# EAGLE design iBolit2_main (EAGLE 7.5.0)
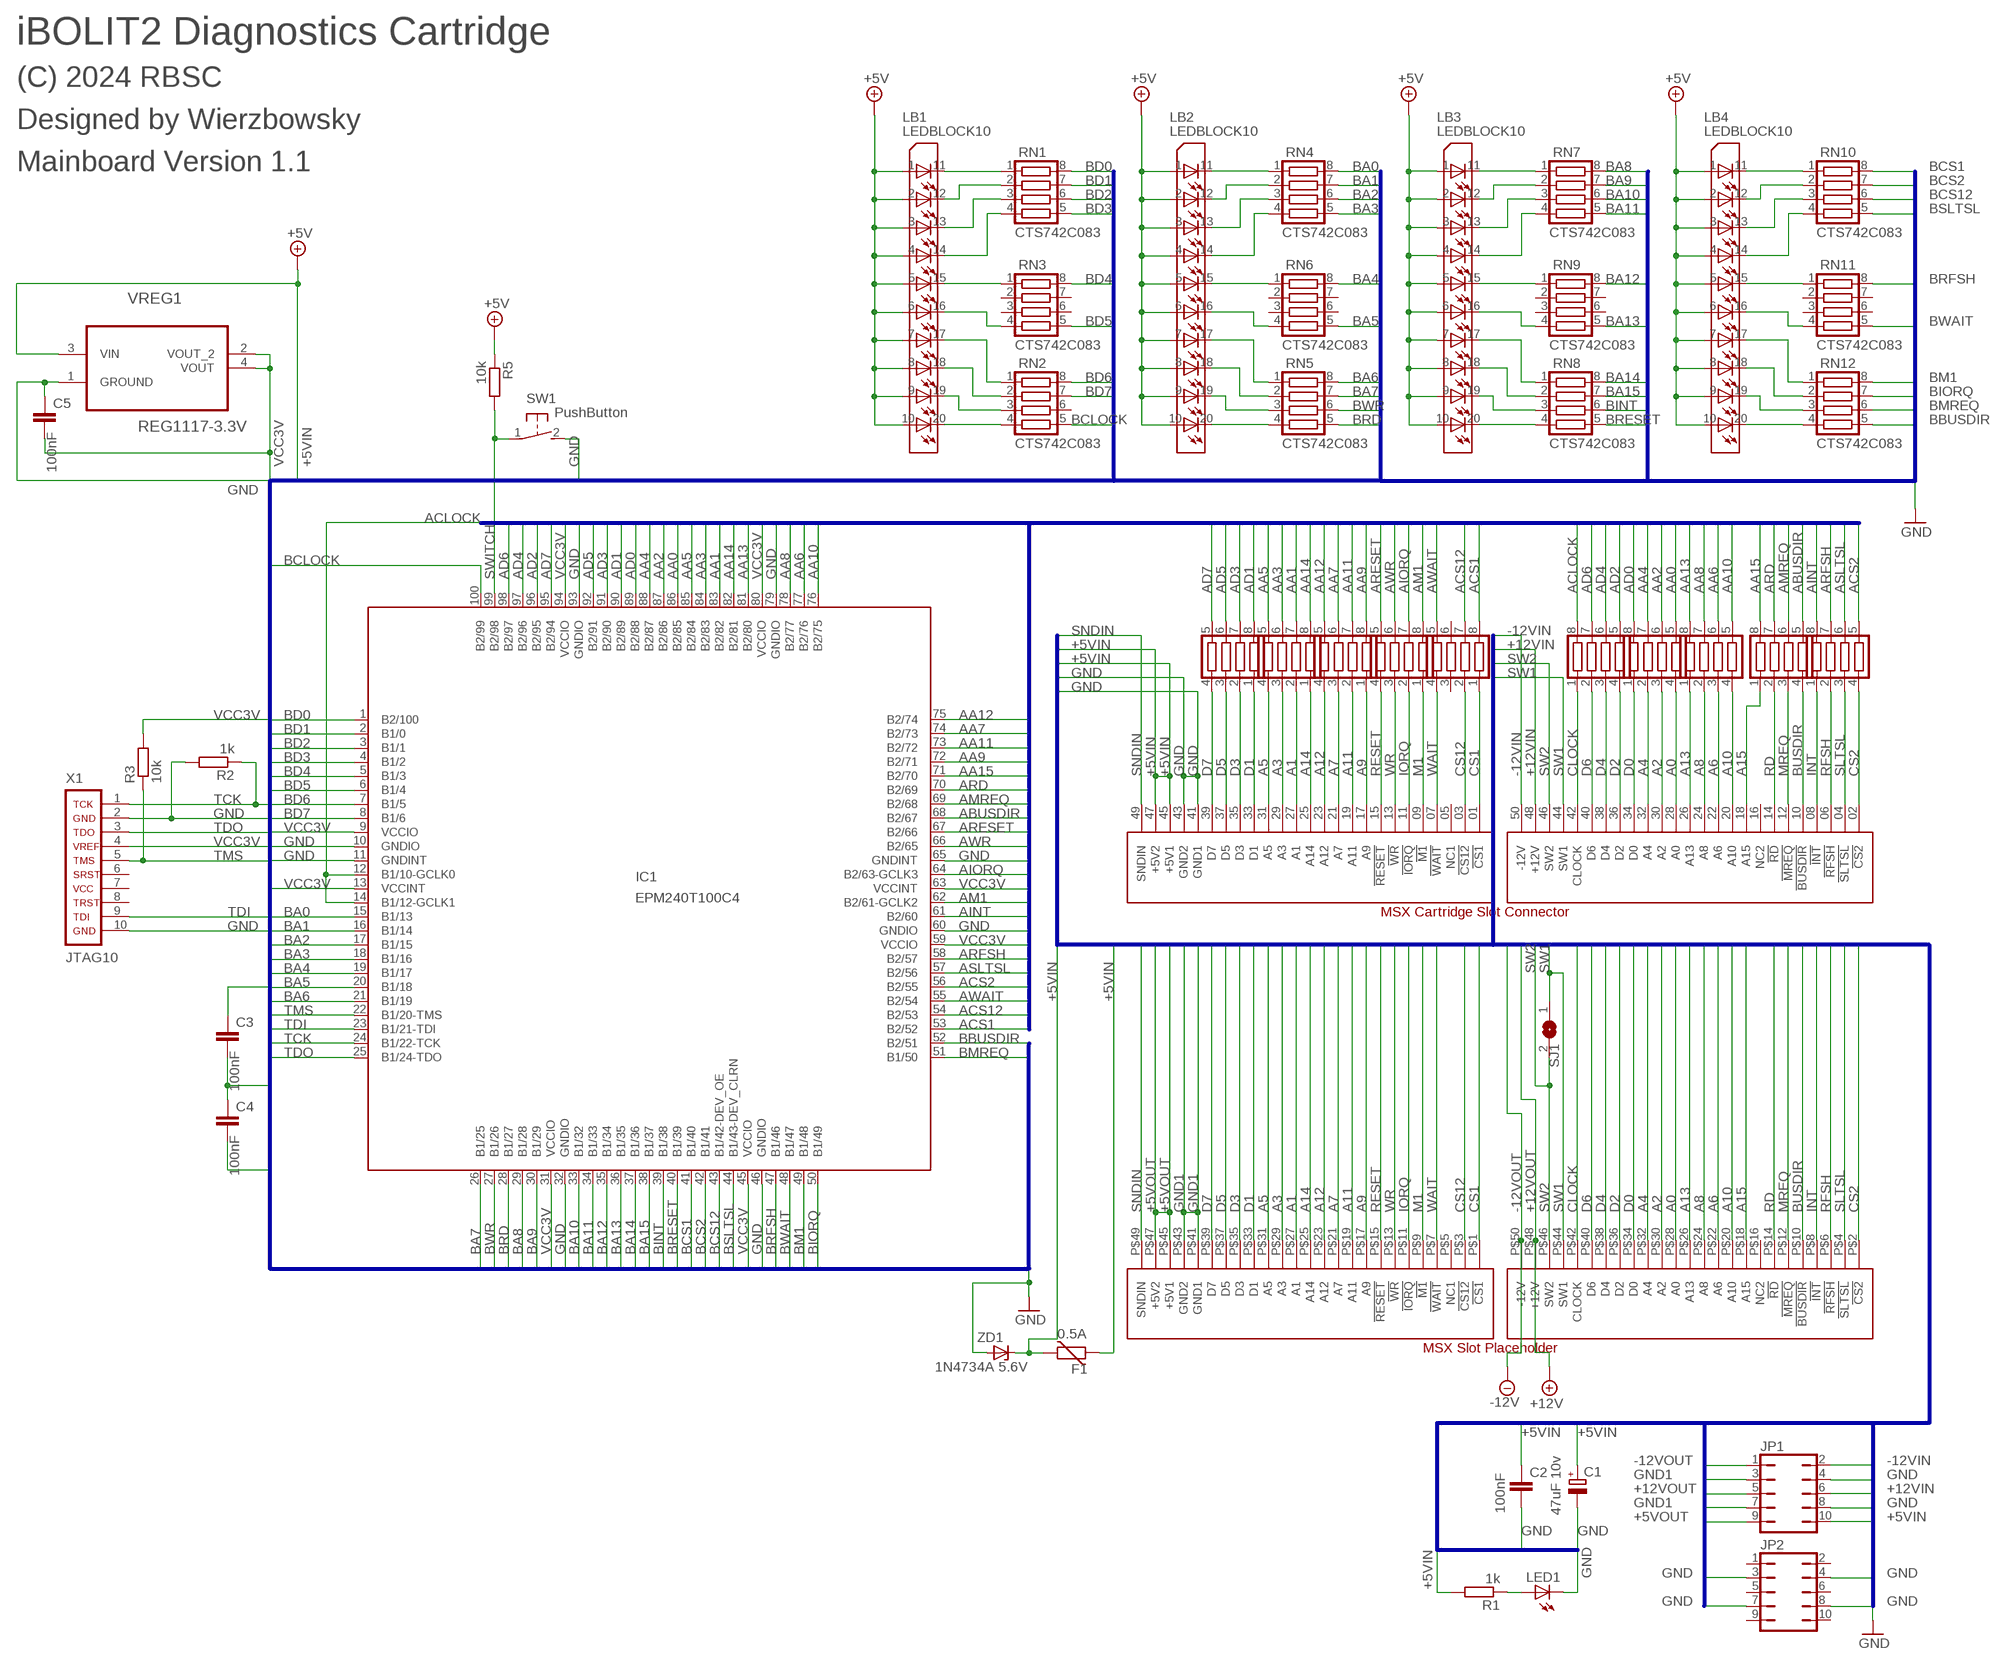
[diagram p0: schematic, sheet 1]

## Parts
C1  47uF 10v  CPOL-EUSMCB  [SMC_B]
C2  100nF  C-EUC0805  [C0805]
C3  100nF  C-EUC0805  [C0805]
C4  100nF  C-EUC0805  [C0805]
C5  100nF  C-EUC0805  [C0805]
CN1  SLOTCONN  MSX_SLOT_CON  [MSX_SLOT_CON]
CN2  SLOTPLACEHOLDER  MSX_SLOT_PLACEHOLDER  [MSX_SLOT_PLP]
F1  VARISTORCN1206  [CT/CN1206]
IC1  EPM240T100C4  [TQFP100]
JP1  JP5Q_CUSTOM  [JP5Q_CUSTOM]
JP2  JP5Q_CUSTOM  [JP5Q_CUSTOM]
LB1  LEDBLOCK10  [LB10]
LB2  LEDBLOCK10  [LB10]
LB3  LEDBLOCK10  [LB10]
LB4  LEDBLOCK10  [LB10]
LED1  LED5MM  [LED5MM]
R1  1k  R-EU_R0805  [R0805]
R2  1k  R-EU_R0805  [R0805]
R3  10k  R-EU_R0805  [R0805]
R5  10k  R-EU_R0805  [R0805]
RN1  CTS742C083  [CTS742C083]
RN2  CTS742C083  [CTS742C083]
RN3  CTS742C083  [CTS742C083]
RN4  CTS742C083  [CTS742C083]
RN5  CTS742C083  [CTS742C083]
RN6  CTS742C083  [CTS742C083]
RN7  CTS742C083  [CTS742C083]
RN8  CTS742C083  [CTS742C083]
RN9  CTS742C083  [CTS742C083]
RN10  CTS742C083  [CTS742C083]
RN11  CTS742C083  [CTS742C083]
RN12  CTS742C083  [CTS742C083]
RN13  CTS742C083  [CTS742C083]
RN14  CTS742C083  [CTS742C083]
RN15  CTS742C083  [CTS742C083]
RN16  CTS742C083  [CTS742C083]
RN17  CTS742C083  [CTS742C083]
RN28  CTS742C083  [CTS742C083]
RN29  CTS742C083  [CTS742C083]
RN30  CTS742C083  [CTS742C083]
RN31  CTS742C083  [CTS742C083]
RN32  CTS742C083  [CTS742C083]
SJ1  SJ  [SJ]
SW1  PushButton  31-XX  [B3F-31XX]
VREG1  REG1117-3.3V  REG1117-3.3  [SOT230P700X180-4N]
X1  JTAG10  [JTAG10]
ZD1  1N4734A 5.6V  ZENER-DIODEZD-7.5  [ZDIO-7.5]

## Nets
+5VIN: C1.+ C2.1 CN1.45(+5V1) CN1.47(+5V2) F1.1 F1.2 JP1.10 LB1.1(L1I) LB1.2(L1I1) LB1.3(L1I2) LB1.4(L1I3) LB1.5(L1I4) LB1.6(L1I5) LB1.7(L1I6) LB1.8(L1I7) LB1.9(L1I8) LB1.10(L1I9) LB2.1(L1I) LB2.2(L1I1) LB2.3(L1I2) LB2.4(L1I3) LB2.5(L1I4) LB2.6(L1I5) LB2.7(L1I6) LB2.8(L1I7) LB2.9(L1I8) LB2.10(L1I9) LB3.1(L1I) LB3.2(L1I1) LB3.3(L1I2) LB3.4(L1I3) LB3.5(L1I4) LB3.6(L1I5) LB3.7(L1I6) LB3.8(L1I7) LB3.9(L1I8) LB3.10(L1I9) LB4.1(L1I) LB4.2(L1I1) LB4.3(L1I2) LB4.4(L1I3) LB4.5(L1I4) LB4.6(L1I5) LB4.7(L1I6) LB4.8(L1I7) LB4.9(L1I8) LB4.10(L1I9) R1.2 R5.1 VREG1.3(VIN) ZD1.C ; supply symbol labelled +5V
+5VOUT: CN2.P$45(+5V1) CN2.P$47(+5V2) JP1.9
+12VIN: CN1.48(+12V) JP1.6
+12VOUT: CN2.P$48(+12V) JP1.5 ; supply symbol labelled +12V
-12VIN: CN1.50(-12V) JP1.2
-12VOUT: CN2.P$50(-12V) JP1.1 ; supply symbol labelled -12V
A0: CN1.28(A0) CN2.P$28(A0) RN29.4
A1: CN1.27(A1) CN2.P$27(A1) RN16.2
A2: CN1.30(A2) CN2.P$30(A2) RN29.3
A3: CN1.29(A3) CN2.P$29(A3) RN16.3
A4: CN1.32(A4) CN2.P$32(A4) RN29.2
A5: CN1.31(A5) CN2.P$31(A5) RN16.4
A6: CN1.22(A6) CN2.P$22(A6) RN30.3
A7: CN1.21(A7) CN2.P$21(A7) RN15.3
A8: CN1.24(A8) CN2.P$24(A8) RN30.2
A9: CN1.17(A9) CN2.P$17(A9) RN15.1
A10: CN1.20(A10) CN2.P$20(A10) RN30.4
A11: CN1.19(A11) CN2.P$19(A11) RN15.2
A12: CN1.23(A12) CN2.P$23(A12) RN15.4
A13: CN1.26(A13) CN2.P$26(A13) RN30.1
A14: CN1.25(A14) CN2.P$25(A14) RN16.1
A15: CN1.18(A15) CN2.P$18(A15) RN32.1
AA0: IC1.86(B2/85) RN29.5
AA1: IC1.83(B2/82) RN16.7
AA2: IC1.87(B2/86) RN29.6
AA3: IC1.84(B2/83) RN16.6
AA4: IC1.88(B2/87) RN29.7
AA5: IC1.85(B2/84) RN16.5
AA6: IC1.77(B2/76) RN30.6
AA7: IC1.74(B2/73) RN15.6
AA8: IC1.78(B2/77) RN30.7
AA9: IC1.72(B2/71) RN15.8
AA10: IC1.76(B2/75) RN30.5
AA11: IC1.73(B2/72) RN15.7
AA12: IC1.75(B2/74) RN15.5
AA13: IC1.81(B2/80) RN30.8
AA14: IC1.82(B2/81) RN16.8
AA15: IC1.71(B2/70) RN32.8
ABUSDIR: IC1.68(B2/67) RN32.5
ACLOCK: IC1.12(B1/10-GCLK0) IC1.14(B1/12-GCLK1) RN28.8
ACS1: IC1.53(B2/52) RN13.8
ACS2: IC1.56(B2/55) RN31.5
ACS12: IC1.54(B2/53) RN13.7
AD0: IC1.89(B2/88) RN29.8
AD1: IC1.90(B2/89) RN17.8
AD2: IC1.96(B2/95) RN28.5
AD3: IC1.91(B2/90) RN17.7
AD4: IC1.97(B2/96) RN28.6
AD5: IC1.92(B2/91) RN17.6
AD6: IC1.98(B2/97) RN28.7
AD7: IC1.95(B2/94) RN17.5
AINT: IC1.61(B2/60) RN31.8
AIORQ: IC1.64(B2/63-GCLK3) RN14.7
AM1: IC1.62(B2/61-GCLK2) RN14.8
AMREQ: IC1.69(B2/68) RN32.6
ARD: IC1.70(B2/69) RN32.7
ARESET: IC1.67(B2/66) RN14.5
ARFSH: IC1.58(B2/57) RN31.7
ASLTSL: IC1.57(B2/56) RN31.6
AWAIT: IC1.55(B2/54) RN13.5
AWR: IC1.66(B2/65) RN14.6
BA0: IC1.15(B1/13) RN4.8
BA1: IC1.16(B1/14) RN4.7
BA2: IC1.17(B1/15) RN4.6
BA3: IC1.18(B1/16) RN4.5
BA4: IC1.19(B1/17) RN6.8
BA5: IC1.20(B1/18) RN6.5
BA6: IC1.21(B1/19) RN5.8
BA7: IC1.26(B1/25) RN5.7
BA8: IC1.29(B1/28) RN7.8
BA9: IC1.30(B1/29) RN7.7
BA10: IC1.33(B1/32) RN7.6
BA11: IC1.34(B1/33) RN7.5
BA12: IC1.35(B1/34) RN9.8
BA13: IC1.36(B1/35) RN9.5
BA14: IC1.37(B1/36) RN8.8
BA15: IC1.38(B1/37) RN8.7
BBUSDIR: IC1.52(B2/51) RN12.5
BCLOCK: IC1.100(B2/99) RN2.5
BCS1: IC1.41(B1/40) RN10.8
BCS2: IC1.42(B1/41) RN10.7
BCS12: IC1.43(B1/42-DEV_OE) RN10.6
BD0: IC1.1(B2/100) RN1.8
BD1: IC1.2(B1/0) RN1.7
BD2: IC1.3(B1/1) RN1.6
BD3: IC1.4(B1/2) RN1.5
BD4: IC1.5(B1/3) RN3.8
BD5: IC1.6(B1/4) RN3.5
BD6: IC1.7(B1/5) RN2.8
BD7: IC1.8(B1/6) RN2.7
BINT: IC1.39(B1/38) RN8.6
BIORQ: IC1.50(B1/49) RN12.7
BM1: IC1.49(B1/48) RN12.8
BMREQ: IC1.51(B1/50) RN12.6
BRD: IC1.28(B1/27) RN5.5
BRESET: IC1.40(B1/39) RN8.5
BRFSH: IC1.47(B1/46) RN11.8
BSLTSL: IC1.44(B1/43-DEV_CLRN) RN10.5
BUSDIR: CN1.10(!BUSDIR) CN2.P$10(!BUSDIR) RN32.4
BWAIT: IC1.48(B1/47) RN11.5
BWR: IC1.27(B1/26) RN5.6
CLOCK: CN1.42(CLOCK) CN2.P$42(CLOCK) RN28.1
CS1: CN1.01(!CS1) CN2.P$1(!CS1) RN13.1
CS2: CN1.02(!CS2) CN2.P$2(!CS2) RN31.4
CS12: CN1.03(!CS12) CN2.P$3(!CS12) RN13.2
D0: CN1.34(D0) CN2.P$34(D0) RN29.1
D1: CN1.33(D1) CN2.P$33(D1) RN17.1
D2: CN1.36(D2) CN2.P$36(D2) RN28.4
D3: CN1.35(D3) CN2.P$35(D3) RN17.2
D4: CN1.38(D4) CN2.P$38(D4) RN28.3
D5: CN1.37(D5) CN2.P$37(D5) RN17.3
D6: CN1.40(D6) CN2.P$40(D6) RN28.2
D7: CN1.39(D7) CN2.P$39(D7) RN17.4
GND: C1.- C2.2 C3.2 C4.1 C5.1 CN1.41(GND1) CN1.43(GND2) IC1.10(GNDIO) IC1.11(GNDINT) IC1.32(GNDIO) IC1.46(GNDIO) IC1.60(GNDIO) IC1.65(GNDINT) IC1.79(GNDIO) IC1.93(GNDIO) JP1.4 JP1.8 JP2.3 JP2.4 JP2.7 JP2.8 LED1.K(C) R2.2 SW1.2(S) VREG1.1(GROUND) X1.2 X1.10 ZD1.A
GND1: CN2.P$41(GND1) CN2.P$43(GND2) JP1.3 JP1.7
INT: CN1.08(!INT) CN2.P$8(!INT) RN31.1
IORQ: CN1.11(!IORQ) CN2.P$11(!IORQ) RN14.2
M1: CN1.09(!M1) CN2.P$9(!M1) RN14.1
MREQ: CN1.12(!MREQ) CN2.P$12(!MREQ) RN32.3
N$1: LED1.A R1.1
N$2: LB4.11(L1O) RN10.1
N$4: LB4.12(L1O1) RN10.2
N$5: LB4.13(L1O2) RN10.3
N$6: LB4.14(L1O3) RN10.4
N$7: LB4.15(L1O4) RN11.1
N$8: LB4.16(L1O5) RN11.4
N$9: LB4.17(L1O6) RN12.1
N$10: LB4.18(L1O7) RN12.2
N$11: LB4.19(L1O8) RN12.3
N$12: LB4.20(L1O9) RN12.4
N$13: LB1.11(L1O) RN1.1
N$14: LB1.12(L1O1) RN1.2
N$15: LB1.13(L1O2) RN1.3
N$16: LB1.14(L1O3) RN1.4
N$17: LB1.15(L1O4) RN3.1
N$18: LB1.16(L1O5) RN3.4
N$19: LB1.17(L1O6) RN2.1
N$20: LB1.18(L1O7) RN2.2
N$21: LB1.19(L1O8) RN2.3
N$22: LB1.20(L1O9) RN2.4
N$23: LB2.11(L1O) RN4.1
N$24: LB2.12(L1O1) RN4.2
N$25: LB2.13(L1O2) RN4.3
N$26: LB2.14(L1O3) RN4.4
N$27: LB2.15(L1O4) RN6.1
N$28: LB2.16(L1O5) RN6.4
N$29: LB2.17(L1O6) RN5.1
N$30: LB2.18(L1O7) RN5.2
N$31: LB2.19(L1O8) RN5.3
N$32: LB2.20(L1O9) RN5.4
N$33: LB3.11(L1O) RN7.1
N$34: LB3.12(L1O1) RN7.2
N$35: LB3.13(L1O2) RN7.3
N$36: LB3.14(L1O3) RN7.4
N$37: LB3.15(L1O4) RN9.1
N$38: LB3.16(L1O5) RN9.4
N$39: LB3.17(L1O6) RN8.1
N$40: LB3.18(L1O7) RN8.2
N$41: LB3.19(L1O8) RN8.3
N$42: LB3.20(L1O9) RN8.4
RD: CN1.14(!RD) CN2.P$14(!RD) RN32.2
RESET: CN1.15(!RESET) CN2.P$15(!RESET) RN14.4
RFSH: CN1.06(!RFSH) CN2.P$6(!RFSH) RN31.2
SLTSL: CN1.04(!SLTSL) CN2.P$4(!SLTSL) RN31.3
SNDIN: CN1.49(SNDIN) CN2.P$49(SNDIN)
SW1: CN1.44(SW1) CN2.P$44(SW1) SJ1.1
SW2: CN1.46(SW2) CN2.P$46(SW2) SJ1.2
SWITCH: IC1.99(B2/98) R5.2 SW1.1(P)
TCK: IC1.24(B1/22-TCK) R2.1 X1.1
TDI: IC1.23(B1/21-TDI) X1.9
TDO: IC1.25(B1/24-TDO) X1.3
TMS: IC1.22(B1/20-TMS) R3.1 X1.5
VCC3V: C3.1 C4.2 C5.2 IC1.9(VCCIO) IC1.13(VCCINT) IC1.31(VCCIO) IC1.45(VCCIO) IC1.59(VCCIO) IC1.63(VCCINT) IC1.80(VCCIO) IC1.94(VCCIO) R3.2 VREG1.2(VOUT_2) VREG1.4(VOUT) X1.4
WAIT: CN1.07(!WAIT) CN2.P$7(!WAIT) RN13.4
WR: CN1.13(!WR) CN2.P$13(!WR) RN14.3
Unconnected: CN1.05(NC1) CN1.16(NC2) CN2.P$5(NC1) CN2.P$16(NC2) JP2.1 JP2.2 JP2.5 JP2.6 JP2.9 JP2.10 RN2.6 RN3.2 RN3.3 RN3.6 RN3.7 RN6.2 RN6.3 RN6.6 RN6.7 RN9.2 RN9.3 RN9.6 RN9.7 RN11.2 RN11.3 RN11.6 RN11.7 RN13.3 RN13.6 X1.6 X1.7 X1.8

## Buses
AD0,AD1,AD2,AD3,AD4,AD5,AD6,AD7,AA0,AA1,AA2,AA3,AA4,AA5,AA6,AA7,AA8,AA9,AA10,AA11,AA12,AA13,AA14,AA15,ASLTSL,ARFSH,AWAIT,AINT,AM1,ABUSDIR,AIORQ,AMREQ,AWR,ARD,ARESET,ACLOCK,ACS1,ACS2,ACS12,GND,VCC3V
BD0,BD1,BD2,BD3,BD4,BD5,BD6,BD7,BA0,BA1,BA2,BA3,BA4,BA5,BA6,BA7,BA8,BA9,BA10,BA11,BA12,BA13,BA14,BA15,BSLTSL,BRFSH,BWAIT,BINT,BM1,BBUSDIR,BIORQ,BMREQ,BWR,BRD,BRESET,BCLOCK,BCS1,BCS2,BCS12,GND,VCC3V,TDO,TDI,TCK,TMS,+5VIN
D0,D1,D2,D3,D4,D5,D6,D7,A0,A1,A2,A3,A4,A5,A6,A7,A8,A9,A10,A11,A12,A13,A14,A15,SLTSL,RFSH,WAIT,INT,M1,BUSDIR,IORQ,MREQ,WR,RD,RESET,CLOCK,CS1,CS2,CS12,+5VIN,GND1,GND2,+12VIN,-12VIN,SNDIN,SW1,SW2,GND,+12VOUT,-12VOUT,+5VOUT,GND1

## Notes on the sheet
- iBOLIT2 Diagnostics Cartridge
- (C) 2024 RBSC
- Designed by Wierzbowsky
- Mainboard Version 1.1
- 0.5A

## Library data of the parts
C1 = rcl:CPOL-EU: POLARIZED CAPACITOR, European symbol
C2-C5 = rcl:C-EU: CAPACITOR, European symbol
CN1 = msx_edge_conn:MSX_SLOT_CON
CN2 = msx_slot_pl:MSX_SLOT_PLACEHOLDER
F1 = varistor:VARISTOR: VARISTOR
IC1 = altera:EPM240T100C4: EPM240T100 Low-cost, low-power CPLD Auto generated by make-symbol-device-package-bsdl.ulp Rev. 35 Source: www.altera.com .. epm240-io.txt; MPN: EPM240T100C4; OC_FARNELL: 1453502; OC_NEWARK: 51R9357
JP1 JP2 = jumper_custom:JP5Q_CUSTOM: JUMPER
LB1-LB4 = ledblock:LEDBLOCK10: LED BLOCK 10-LED bar graph, DIL, Siemens
LED1 = led:LED: LED OSRAM: - CHIPLED LG R971, LG N971, LY N971, LG Q971, LY Q971, LO R971, LY R971 LH N974, LH R974 LS Q976, LO Q976, LY Q976 LO Q996 - Hyper CHIPLED LW Q18S LB Q993, LB Q99A, LB R99A - SideLED LS A670, LO A670, LY A670, LG A670, LP A670 LB A673, LV A673, LT A673, LW A673 LH A674 LY A675 LS A676, LA A676, LO A676, LY A676, LW A676 LS A679, LY A679, LG A679 - Hyper Micro SIDELED® LS Y876, LA Y876, LO Y876, LY Y876 LT Y87S - SmartLED LW L88C, LW L88S LB L89C, LB L89S, LG L890 LS L89K, LO L89K, LY L89K LS L896, LA L896, LO L896, LY L896 - TOPLED LS T670, LO T670, LY T670, LG T670, LP T670 LSG T670, LSP T670, LSY T670, LOP T670, LYG T670 LG T671, LOG T671, LSG T671 LB T673, LV T673, LT T673, LW T673 LH T674 LS T676, LA T676, LO T676, LY T676, LB T676, LH T676, LSB T676, LW T676 LB T67C, LV T67C, LT T67C, LS T67K, LO T67K, LY T67K, LW E67C LS E67B, LA E67B, LO E67B, LY E67B, LB E67C, LV E67C, LT E67C LW T67C LS T679, LY T679, LG T679 LS T770, LO T770, LY T770, LG T770, LP T770 LB T773, LV T773, LT T773, LW T773 LH T774 LS E675, LA E675, LY E675, LS T675 LS T776, LA T776, LO T776, LY T776, LB T776 LHGB T686 LT T68C, LB T68C - Hyper Mini TOPLED® LB M676 - Mini TOPLED Santana® LG M470 LS M47K, LO M47K, LY M47K Source: http://www.osram.convergy.de LUXEON: - LUMILED® LXK2-PW12-R00, LXK2-PW12-S00, LXK2-PW14-U00, LXK2-PW14-V00 LXK2-PM12-R00, LXK2-PM12-S00, LXK2-PM14-U00 LXK2-PE12-Q00, LXK2-PE12-R00, LXK2-PE12-S00, LXK2-PE14-T00, LXK2-PE14-U00 LXK2-PB12-K00, LXK2-PB12-L00, LXK2-PB12-M00, LXK2-PB14-N00, LXK2-PB14-P00, LXK2-PB14-Q00 LXK2-PR12-L00, LXK2-PR12-M00, LXK2-PR14-Q00, LXK2-PR14-R00 LXK2-PD12-Q00, LXK2-PD12-R00, LXK2-PD12-S00 LXK2-PH12-R00, LXK2-PH12-S00 LXK2-PL12-P00, LXK2-PL12-Q00, LXK2-PL12-R00 Source: www.luxeon.com KINGBRIGHT: KA-3528ASYC Source: www.kingbright.com
R1-R3 R5 = resistor:R-EU_: RESISTOR, European symbol
RN1-RN17 RN28-RN32 = resistor-net:CTS742C083: Chip Resistor Array 4 Single Resistor Source: http://www.ctscorp.com/components/Datasheets/CTSChipArrayDs.pdf; OC_FARNELL: unknown; OC_NEWARK: unknown
SJ1 = jumper:SJ: SMD solder JUMPER
SW1 = switch-omron:31-XX: OMRON SWITCH; MPN: B3F-3100; OC_FARNELL: 959704; OC_NEWARK: 36M3582
VREG1 = Texas Instruments_By_element14_Batch_1:REG1117-3.3: Low Dropout Positive Regulator; MPN: REG1117-3.3; OC_FARNELL: 1212355; OC_NEWARK: 35C1963; PACKAGE: SOT-223-4; SUPPLIER: Texas Instruments
X1 = JTAG:JTAG10: AVR JTAG Debug/Programming Header
ZD1 = diode:ZENER-DIODE: Z-Diode

## Board
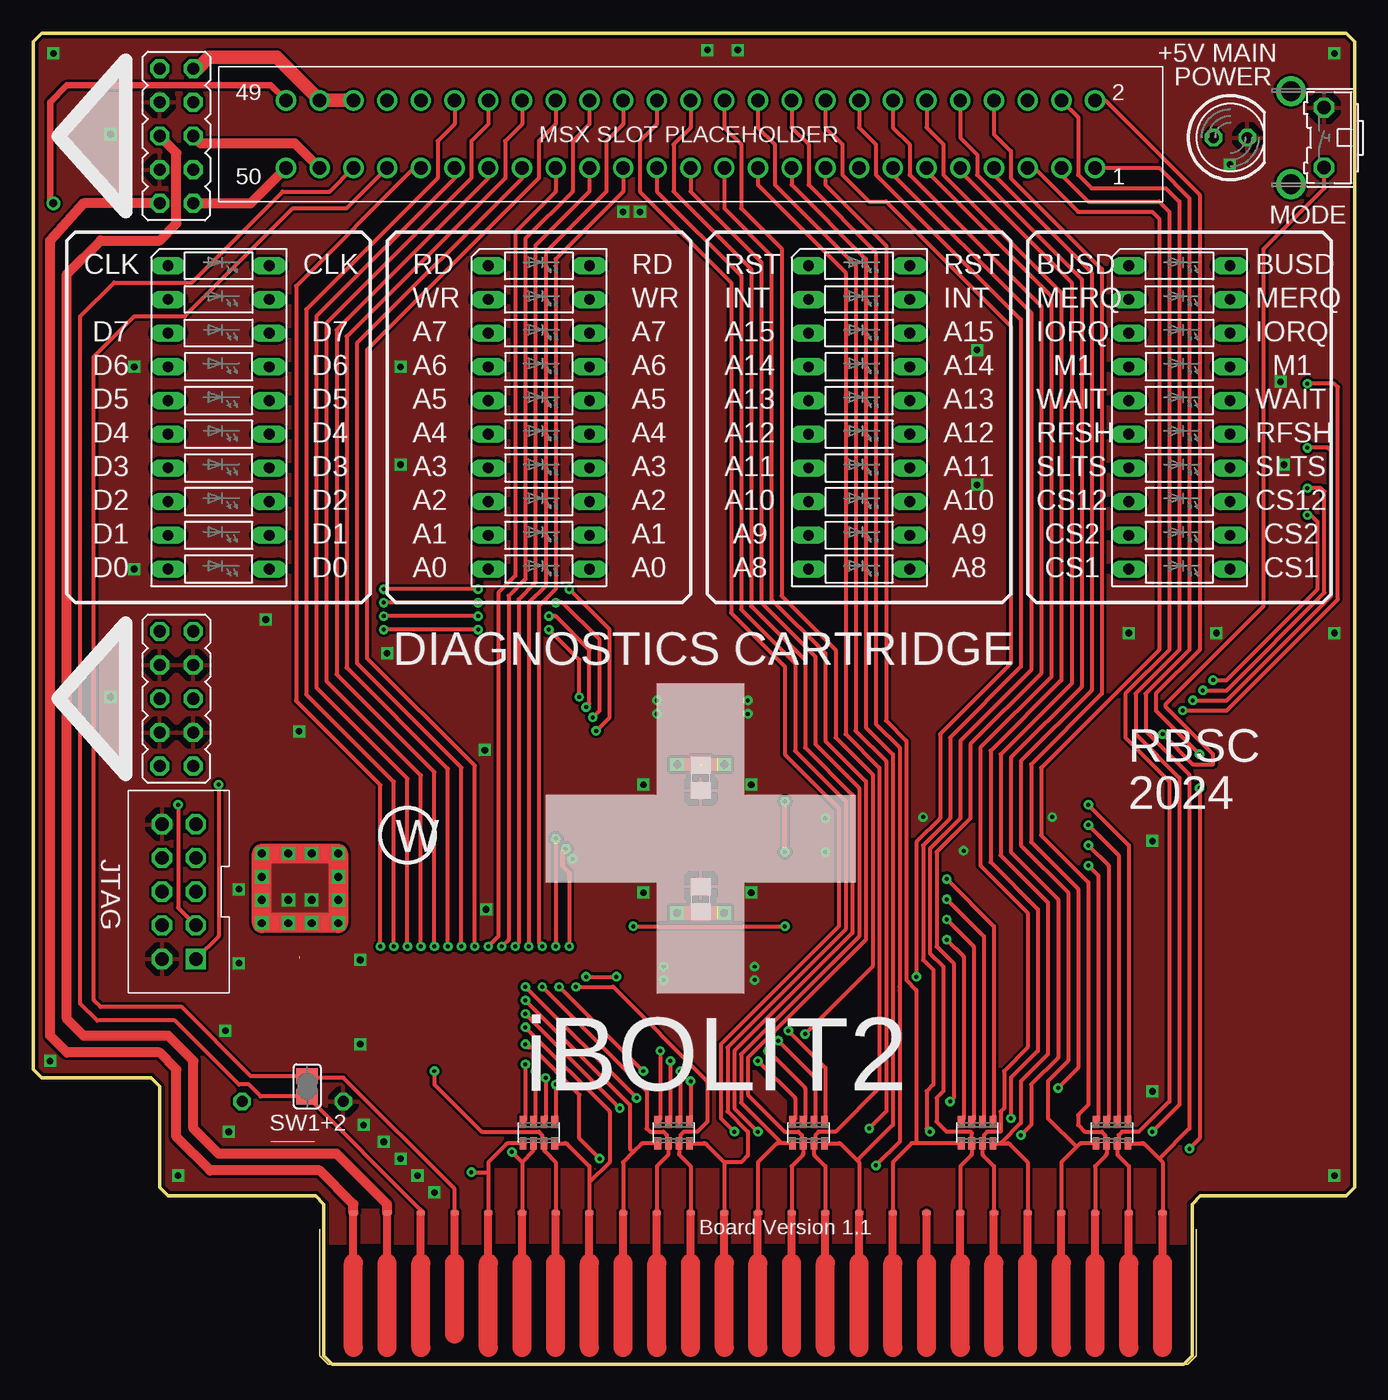
[diagram p1: board, top side]
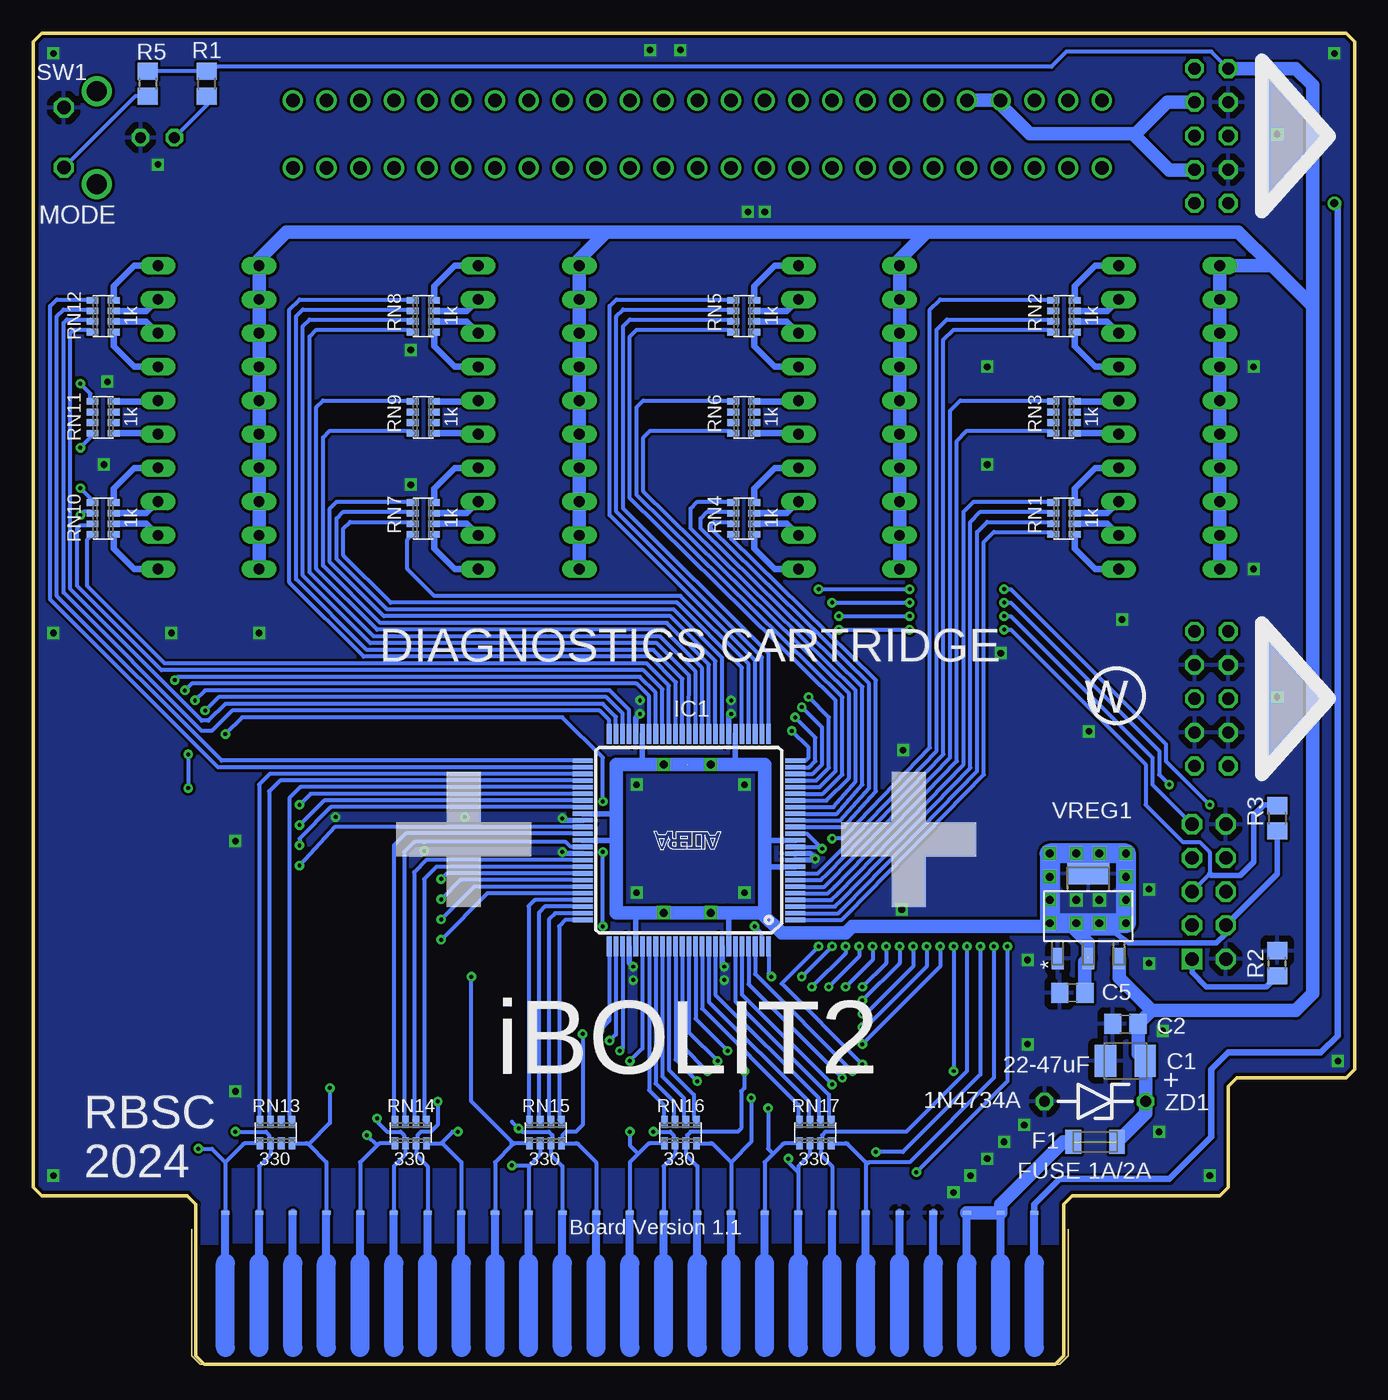
[diagram p2: board, bottom side, seen from below]

Size 99.57 x 100.33 mm. Coordinates in mm from the lower left corner, seen from the top.
Outline: 87.95,12.7 98.93,12.7 99.57,13.34 99.57,99.69 98.93,100.33 0.64,100.33 0,99.69 0,22.23 0.64,21.59 8.89,21.59 9.53,20.95 9.53,13.34 10.16,12.7 21.27,12.7 21.91,12.06 21.91,0.64 22.54,0 86.68,0 87.31,0.64 87.31,12.06 87.95,12.7
Copper layers (1*16): Top 0.035mm / dielectric 1.5mm / Bottom 0.035mm
Design rules "default *": minimum track width 10mil, minimum drill 24mil, track to track 8mil, track to pad 8mil, pad to pad 8mil, via to via 8mil, smd to smd 8mil, copper to edge 10mil, drill to drill 8mil, minimum pad ring 10mil, minimum via ring 8mil, stop-mask expansion 4mil, vias tented up to drill 25mil, thermal gap 20mil

### Footprints (pad centres in the part's own frame; a part is rotated, then mirrored left to right if it is on the bottom)
SMC_B = smd 1.6 x 2.4: + -1.5,0; - 1.5,0
C0805 = smd 1.3 x 1.5: 1 -0.95,0; 2 0.95,0
MSX_SLOT_CON = smd 0.61 x 0.305 bottom: 01 30.48,11.43; 03 27.94,11.43; 05 25.4,11.43; 07 22.86,11.43; 09 20.32,11.43; 11 17.78,11.43; 13 15.24,11.43; 15 12.7,11.43; 17 10.16,11.43; 19 7.62,11.43; 21 5.08,11.43; 23 2.54,11.43; 25 0,11.43; 27 -2.54,11.43; 29 -5.08,11.43; 31 -7.62,11.43; 33 -10.16,11.43; 35 -12.7,11.43; 37 -15.24,11.43; 39 -17.78,11.43; 41 -20.32,11.43; 43 -22.86,11.43; 45 -25.4,11.43; 47 -27.94,11.43; 49 -30.48,11.43 | smd 0.61 x 0.305: 02 30.48,11.43; 04 27.94,11.43; 06 25.4,11.43; 08 22.86,11.43; 10 20.32,11.43; 12 17.78,11.43; 14 15.24,11.43; 16 12.7,11.43; 18 10.16,11.43; 20 7.62,11.43; 22 5.08,11.43; 24 2.54,11.43; 26 0,11.43; 28 -2.54,11.43; 30 -5.08,11.43; 32 -7.62,11.43; 34 -10.16,11.43; 36 -12.7,11.43; 38 -15.24,11.43; 40 -17.78,11.43; 42 -20.32,11.43; 44 -22.86,11.43; 46 -25.4,11.43; 48 -27.94,11.43; 50 -30.48,11.43
MSX_SLOT_PLP = drill 1.016: P$1 63.5,7.62; P$2 63.5,2.54; P$3 60.96,7.62; P$4 60.96,2.54; P$5 58.42,7.62; P$6 58.42,2.54; P$7 55.88,7.62; P$8 55.88,2.54; P$9 53.34,7.62; P$10 53.34,2.54; P$11 50.8,7.62; P$12 50.8,2.54; P$13 48.26,7.62; P$14 48.26,2.54; P$15 45.72,7.62; P$16 45.72,2.54; P$17 43.18,7.62; P$18 43.18,2.54; P$19 40.64,7.62; P$20 40.64,2.54; P$21 38.1,7.62; P$22 38.1,2.54; P$23 35.56,7.62; P$24 35.56,2.54; P$25 33.02,7.62; P$26 33.02,2.54; P$27 30.48,7.62; P$28 30.48,2.54; P$29 27.94,7.62; P$30 27.94,2.54; P$31 25.4,7.62; P$32 25.4,2.54; P$33 22.86,7.62; P$34 22.86,2.54; P$35 20.32,7.62; P$36 20.32,2.54; P$37 17.78,7.62; P$38 17.78,2.54; P$39 15.24,7.62; P$40 15.24,2.54; P$41 12.7,7.62; P$42 12.7,2.54; P$43 10.16,7.62; P$44 10.16,2.54; P$45 7.62,7.62; P$46 7.62,2.54; P$47 5.08,7.62; P$48 5.08,2.54; P$49 2.54,7.62; P$50 2.54,2.54
CT/CN1206 = smd 1.2 x 1.8: 1 -1.65,0; 2 1.65,0
TQFP100 = smd 1.5 x 0.35: 1 -8,6; 2 -8,5.5; 3 -8,5; 4 -8,4.5; 5 -8,4; 6 -8,3.5; 7 -8,3; 8 -8,2.5; 9 -8,2; 10 -8,1.5; 11 -8,1; 12 -8,0.5; 13 -8,0; 14 -8,-0.5; 15 -8,-1; 16 -8,-1.5; 17 -8,-2; 18 -8,-2.5; 19 -8,-3; 20 -8,-3.5; 21 -8,-4; 22 -8,-4.5; 23 -8,-5; 24 -8,-5.5; 25 -8,-6; 51 8,-6; 52 8,-5.5; 53 8,-5; 54 8,-4.5; 55 8,-4; 56 8,-3.5; 57 8,-3; 58 8,-2.5; 59 8,-2; 60 8,-1.5; 61 8,-1; 62 8,-0.5; 63 8,0; 64 8,0.5; 65 8,1; 66 8,1.5; 67 8,2; 68 8,2.5; 69 8,3; 70 8,3.5; 71 8,4; 72 8,4.5; 73 8,5; 74 8,5.5; 75 8,6 | smd 0.35 x 1.5: 26 -6,-8; 27 -5.5,-8; 28 -5,-8; 29 -4.5,-8; 30 -4,-8; 31 -3.5,-8; 32 -3,-8; 33 -2.5,-8; 34 -2,-8; 35 -1.5,-8; 36 -1,-8; 37 -0.5,-8; 38 0,-8; 39 0.5,-8; 40 1,-8; 41 1.5,-8; 42 2,-8; 43 2.5,-8; 44 3,-8; 45 3.5,-8; 46 4,-8; 47 4.5,-8; 48 5,-8; 49 5.5,-8; 50 6,-8; 76 6,8; 77 5.5,8; 78 5,8; 79 4.5,8; 80 4,8; 81 3.5,8; 82 3,8; 83 2.5,8; 84 2,8; 85 1.5,8; 86 1,8; 87 0.5,8; 88 0,8; 89 -0.5,8; 90 -1,8; 91 -1.5,8; 92 -2,8; 93 -2.5,8; 94 -3,8; 95 -3.5,8; 96 -4,8; 97 -4.5,8; 98 -5,8; 99 -5.5,8; 100 -6,8
JP5Q_CUSTOM = drill 0.914 octagon: 1 -5.08,-1.27; 2 -5.08,1.27; 3 -2.54,-1.27; 4 -2.54,1.27; 5 0,-1.27; 6 0,1.27; 7 2.54,-1.27; 8 2.54,1.27; 9 5.08,-1.27; 10 5.08,1.27
LB10 = drill 0.813 long: 1 -11.43,-3.81; 2 -8.89,-3.81; 3 -6.35,-3.81; 4 -3.81,-3.81; 5 -1.27,-3.81; 6 1.27,-3.81; 7 3.81,-3.81; 8 6.35,-3.81; 9 8.89,-3.81; 10 11.43,-3.81; 11 11.43,3.81; 12 8.89,3.81; 13 6.35,3.81; 14 3.81,3.81; 15 1.27,3.81; 16 -1.27,3.81; 17 -3.81,3.81; 18 -6.35,3.81; 19 -8.89,3.81; 20 -11.43,3.81
LED5MM = drill 0.813 octagon: A -1.27,0; K 1.27,0
R0805 = smd 1.3 x 1.5: 1 -0.95,0; 2 0.95,0
CTS742C083 = smd 0.5 x 0.9: 1 -1.2,-0.8; 2 -0.4,-0.8; 3 0.4,-0.8; 4 1.2,-0.8; 5 1.2,0.8; 6 0.4,0.8; 7 -0.4,0.8; 8 -1.2,0.8
SJ = smd 1.168 x 1.6: 1 -0.762,0; 2 0.762,0
B3F-31XX = drill 1.016 octagon: 1 -2.261,-1.245; 2 2.261,-1.245 | drill 1.499 pad 2.159: 3 -3.505,1.245; 4 3.505,1.245
SOT230P700X180-4N = smd 1.626 x 0.889: 1 -3.2,2.311; 2 -3.2,0; 3 -3.2,-2.311 | smd 1.626 x 3.175: 4 3.2,0
JTAG10 = drill 1.016 square: 1 -5.08,-1.27 | drill 1.016 octagon: 2 -5.08,1.27; 3 -2.54,-1.27; 4 -2.54,1.27; 5 0,-1.27; 6 0,1.27; 7 2.54,-1.27; 8 2.54,1.27; 9 5.08,-1.27; 10 5.08,1.27
ZDIO-7.5 = drill 0.813 octagon: A 3.81,0; C -3.81,0

### Placement (x,y rotation side)
C1  17.27,22.86 180 bottom
C2  17.27,25.65 180 bottom
C3  50.29,44.2 270 top
C4  50.29,35.05 270 top
C5  21.27,28 0 bottom
CN1  54.61,0 0 top
CN2  16.51,87.64 0 top
F1  19.56,16.76 0 bottom
IC1  50.16,39.5 180 bottom
JP1  10.79,92.58 90 top
JP2  10.79,50.16 90 top
LB1  13.97,71.37 270 top
LB2  38.1,71.37 270 top
LB3  62.23,71.37 270 top
LB4  86.36,71.37 270 top
LED1  90.21,92.46 0 top
R1  86.49,96.52 90 bottom
R2  5.84,30.23 90 bottom
R3  5.84,41.15 270 bottom
R5  90.93,96.52 270 bottom
RN1  21.91,63.75 90 bottom
RN2  21.91,78.99 90 bottom
RN3  21.91,71.37 90 bottom
RN4  46.04,63.75 90 bottom
RN5  46.04,78.99 90 bottom
RN6  46.04,71.37 90 bottom
RN7  70.17,63.75 90 bottom
RN8  70.17,78.99 90 bottom
RN9  70.17,71.37 90 bottom
RN10  94.3,63.75 90 bottom
RN11  94.3,71.37 90 bottom
RN12  94.3,78.99 90 bottom
RN13  81.28,17.46 0 bottom
RN14  71.12,17.46 0 bottom
RN15  60.96,17.46 0 bottom
RN16  50.8,17.46 0 bottom
RN17  40.64,17.46 0 bottom
RN28  38.1,17.46 0 top
RN29  48.26,17.46 0 top
RN30  58.42,17.46 0 top
RN31  81.28,17.46 0 top
RN32  71.12,17.46 0 top
SJ1  20.64,20.95 270 top
SW1  96.01,92.46 90 top
VREG1  20.07,33.78 90 bottom
X1  10.98,35.62 90 top
ZD1  19.56,19.81 180 bottom

### Tracks (layer width: path | path; a pad name or v marks a point on that pad's centre or on a via)
+5VIN  (1 unrouted)
  Bottom 0.3: JP1.10 10.79,98.93 21.72,98.93 22.86,97.79 86.17,97.79 R1.2 R5.1
  Bottom 1: CN1.45 CN1.47 | LB3.10 LB3.9 LB3.8 LB3.7 LB3.6 LB3.5 LB3.4 LB3.3 LB3.2 LB3.1 58.42,83.31 56.39,85.34 | LB4.10 LB4.9 LB4.8 LB4.7 LB4.6 LB4.5 LB4.4 LB4.3 LB4.2 LB4.1 82.55,83.31 80.52,85.34 56.39,85.34 | LB1.10 LB1.9 LB1.8 LB1.7 LB1.6 LB1.5 LB1.4 LB1.3 LB1.2 LB1.1 6.22,82.8 | LB2.10 LB2.9 LB2.8 LB2.7 LB2.6 LB2.5 LB2.4 LB2.3 LB2.2 LB2.1 34.29,83.31 32.26,85.34 | 6.22,82.8 3.18,79.76 | 32.26,85.34 8.76,85.34 6.22,82.8 | 56.39,85.34 32.26,85.34
  Bottom 1.016: CN1.47 26.67,12.06 21.97,16.76 F1.1 | JP1.10 4.45,97.66 3.18,96.39 3.18,79.76 3.18,27.94 4.45,26.67 15.31,26.67 | F1.2 15.75,18.92 ZD1.C 15.75,22.84 C1.+ 16.32,23.41 C2.1 15.31,26.67 | VREG1.3 17.75,29.12 15.31,26.67
+5VOUT
  Top 1: JP1.9 12.39,97.66 13.23,98.5 18.35,98.5 CN2.P$47 CN2.P$45
+12VIN
  Top 0.762: CN1.48 26.67,12.06 22.86,15.88 13.97,15.88 12.07,17.78 12.07,22.86 10.16,24.77 3.81,24.77 2.54,26.04 2.54,82.17 5.08,84.71 9.53,84.71 10.79,85.98 10.79,91.31 JP1.6
+12VOUT
  Top 0.75: CN2.P$48 21.55,90.18 19.73,92 12.65,92 JP1.5
-12VIN
  Top 0.762: CN1.50 24.13,12.06 21.59,14.61 13.34,14.61 10.79,17.14 10.79,22.23 9.53,23.5 2.54,23.5 1.27,24.77 1.27,84.71 3.81,87.5 JP1.2
-12VOUT
  Top 0.75: 16.38,87.5 CN2.P$50
  Top 0.762: JP1.1 15.88,87.5 16.38,87.5
A0
  Top 0.3: RN29.4 50.54,16.66 arc-45 50.72,16.59 52.07,15.24 | 52.07,15.24 CN1.28 | CN2.P$28 46.99,88.39 53.34,82.04 53.34,56.9 57.4,52.83 57.4,46.23 61.21,42.42 61.21,32.77 52.32,23.88 52.32,19.05 53.85,17.53 53.85,15.75 53.34,15.24 52.07,15.24
A1  (via drill 0.3)
  Top 0.3: CN2.P$27 46.99,93.47 45.72,92.2 45.72,88.39 52.58,81.53 52.58,56.64 56.64,52.58 56.64,45.97 60.71,41.91 60.71,33.02 51.82,24.13 51.82,18.54 v52.83,17.53
  Bottom 0.3: CN1.27 52.07,14.92 51.27,15.72 arc-45 51.2,15.9 RN16.2 51.31,16.77 51.31,17.27 51.56,17.53 v52.83,17.53
A2  (via drill 0.3)
  Top 0.3: CN1.30 49.53,14.92 48.73,15.72 arc-45 48.66,15.9 RN29.3 48.77,16.77 48.77,17.27 49.02,17.53 50.04,17.53 50.8,18.29 50.8,21.34 43.69,28.45 v40.89,28.45 | CN2.P$30 44.45,88.39 39.37,83.31 39.37,58.42 38.1,57.15 38.1,31.75 v38.35,31.5
  Bottom 0.3: v38.35,31.5 38.35,30.99 v40.89,28.45
A3  (via drill 0.3)
  Top 0.3: CN2.P$29 44.45,93.47 43.18,92.2 43.18,88.39 38.61,83.82 38.61,58.67 37.34,57.4 v37.34,31.5 | v39.62,28.45 v45.97,22.1
  Bottom 0.3: CN1.29 49.53,14.92 50.33,15.72 arc45 50.4,15.9 RN16.3 50.29,16.77 50.29,17.27 50.04,17.53 46.48,17.53 46.23,17.78 46.23,20.57 45.97,20.83 v45.97,22.1 | v37.34,31.5 37.34,30.73 v39.62,28.45
A4  (via drill 0.3)
  Top 0.3: CN1.32 46.99,14.92 47.79,15.72 arc45 47.86,15.9 RN29.2 47.75,16.77 47.75,17.27 47.5,17.53 46.48,17.53 46.23,17.78 46.23,20.57 v38.35,28.45 | CN2.P$32 41.91,88.39 37.85,84.33 37.85,58.93 36.58,57.66 36.58,31.75 v36.32,31.5
  Bottom 0.3: v36.32,31.5 36.32,30.48 v38.35,28.45
A5  (via drill 0.3)
  Top 0.3: CN2.P$31 41.91,93.47 40.64,92.2 40.64,88.39 37.08,84.84 37.08,59.18 35.81,57.91 35.81,32 v35.31,31.5 | v37.08,28.45 v45.47,20.07
  Bottom 0.3: RN16.4 48.52,16.66 arc45 48.34,16.59 46.99,15.24 | 46.99,15.24 CN1.31 | v35.31,31.5 35.31,30.23 v37.08,28.45 | v45.47,20.07 45.47,16.76 46.99,15.24
A6
  Top 0.3: CN1.22 59.69,14.92 58.89,15.72 arc-45 58.82,15.9 RN30.3 58.93,16.77 58.93,17.27 59.18,17.53 60.45,17.53 63.75,20.83 63.75,44.96 61.21,47.5 61.21,82.3 54.61,88.9 CN2.P$22
A7  (via drill 0.3)
  Top 0.3: CN2.P$21 54.61,93.22 55.88,91.95 55.88,88.9 61.98,82.8 61.98,47.75 64.26,45.47 64.26,19.05 v62.99,17.78
  Bottom 0.3: CN1.21 59.69,14.92 60.49,15.72 arc45 60.56,15.9 RN15.3 60.45,16.77 60.45,17.27 60.71,17.53 62.74,17.53 v62.99,17.78 63.5,18.29
A8
  Top 0.3: CN1.24 57.15,14.92 57.95,15.72 arc45 58.02,15.9 RN30.2 57.91,16.77 57.91,17.27 57.66,17.53 56.64,17.53 53.85,20.32 53.85,23.11 62.74,32 62.74,43.94 59.69,46.99 59.69,53.59 55.63,57.66 55.63,83.57 52.07,87.12 CN2.P$24
A9  (via drill 0.3)
  Top 0.3: CN2.P$17 59.69,93.22 60.96,91.95 60.96,89.66 62.99,87.63 64.26,87.63 73.66,78.23 73.66,52.83 68.33,47.5 68.33,41.15 66.55,39.37 v66.55,29.21
  Bottom 0.3: RN15.1 63.24,16.66 arc-45 63.42,16.59 63.5,16.51 | 63.5,16.51 64.77,15.24 CN1.17 | 63.5,16.51 63.5,16.76 66.55,19.81 v66.55,29.21
A10
  Top 0.3: RN30.4 60.7,16.66 arc-45 60.88,16.59 62.1,15.37 | 62.1,15.37 62.23,15.24 CN1.20 | CN2.P$20 57.15,88.9 62.74,83.31 62.74,48.01 64.77,45.97 64.77,18.03 62.1,15.37
A11  (via drill 0.3)
  Top 0.3: CN2.P$19 57.15,93.22 58.42,91.95 58.42,88.9 63.5,83.82 63.5,48.26 65.28,46.48 65.28,28.45 65.28,28.19 65.28,16.76 v63.5,14.99
  Bottom 0.3: RN15.2 61.36,15.9 arc45 61.43,15.72 62.2,14.95 | 62.2,14.95 62.23,14.92 CN1.19 | v63.5,14.99 62.23,14.99 62.2,14.95
A12  (via drill 0.3)
  Top 0.3: CN2.P$23 52.07,93.22 53.34,91.95 53.34,87.12 56.39,84.07 56.39,57.91 60.45,53.85 60.45,47.24 63.25,44.45 63.25,29.97 v58.17,24.89
  Bottom 0.3: CN1.23 57.15,15.24 58.5,16.59 arc-45 58.68,16.66 RN15.4 59.69,16.73 59.69,17.27 59.44,17.53 58.67,17.53 58.17,18.03 v58.17,24.89
A13
  Top 0.3: RN30.1 56.39,16.66 | 56.39,16.66 56.14,16.66 arc45 55.96,16.59 54.61,15.24 CN1.26 | CN2.P$26 49.53,88.39 54.86,83.06 54.86,57.4 58.93,53.34 58.93,46.74 62.23,43.43 62.23,32.26 53.34,23.37 53.34,19.71 56.39,16.66
A14  (via drill 0.3)
  Top 0.3: CN2.P$25 49.53,93.22 48.26,91.95 48.26,88.39 54.1,82.55 54.1,57.15 58.17,53.09 58.17,46.48 61.72,42.93 61.72,32.51 52.83,23.62 52.83,19.3 v54.61,17.53
  Bottom 0.3: RN16.1 53.08,16.66 arc-45 53.26,16.59 53.97,15.88 | 53.97,15.88 54.61,15.24 CN1.25 | v54.61,17.53 54.61,16.51 53.97,15.88
A15
  Top 0.3: RN32.1 66.55,16.66 | 66.55,16.66 66.19,16.66 64.77,15.24 CN1.18 | CN2.P$18 59.69,88.9 64.26,84.33 64.26,48.51 65.79,46.99 65.79,28.96 66.55,28.19 66.55,16.66
AA0  (via drill 0.3)
  Top 0.3: v49.53,21.34 49.53,18.33 RN29.5
  Bottom 0.3: IC1.86 51.16,22.97 v49.53,21.34
AA1
  Bottom 0.3: IC1.83 52.66,21.17 51.31,19.81 51.31,18.37 RN16.7
AA2  (via drill 0.3)
  Top 0.3: v48.77,22.1 48.77,18.37 RN29.6
  Bottom 0.3: IC1.87 50.66,24 v48.77,22.1
AA3
  Bottom 0.3: IC1.84 52.16,21.68 50.55,20.07 50.55,18.41 RN16.6
AA4  (via drill 0.3)
  Top 0.3: v48.01,22.86 48.01,18.41 RN29.7
  Bottom 0.3: IC1.88 50.16,25.02 v48.01,22.86
AA5
  Bottom 0.3: IC1.85 51.66,22.2 49.78,20.32 49.78,18.45 RN16.5
AA6  (via drill 0.3)
  Top 0.3: v56.13,24.38 58.93,21.59 58.93,18.37 RN30.6
  Bottom 0.3: IC1.77 55.66,24.85 v56.13,24.38
AA7
  Bottom 0.3: IC1.74 60.24,34 60.71,33.53 60.71,18.41 RN15.6
AA8  (via drill 0.3)
  Top 0.3: v55.37,23.62 58.17,20.83 58.17,18.41 RN30.7
  Bottom 0.3: IC1.78 55.16,23.83 v55.37,23.62
AA9
  Bottom 0.3: IC1.72 61.78,35 62.23,34.54 62.23,18.33 RN15.8
AA10  (via drill 0.3)
  Top 0.3: v56.9,25.15 59.69,22.35 59.69,18.33 RN30.5
  Bottom 0.3: IC1.76 56.16,25.88 v56.9,25.15
AA11
  Bottom 0.3: IC1.73 61.01,34.5 61.47,34.04 61.47,18.37 RN15.7
AA12
  Bottom 0.3: IC1.75 59.47,33.5 59.94,33.02 59.94,18.45 RN15.5
AA13  (via drill 0.3)
  Top 0.3: v54.61,22.86 57.4,20.07 57.4,18.45 RN30.8
  Bottom 0.3: IC1.81 53.66,23.8 v54.61,22.86
AA14
  Bottom 0.3: IC1.82 53.16,20.65 52.07,19.56 52.07,18.33 RN16.8
AA15  (via drill 0.3)
  Top 0.3: v68.83,32 70.1,30.73 70.1,18.45 RN32.8
  Bottom 0.3: IC1.71 65.34,35.5 v68.83,32
ABUSDIR  (via drill 0.3)
  Top 0.3: v68.83,36.58 72.39,33.02 72.39,18.33 RN32.5
  Bottom 0.3: IC1.68 68.41,37 v68.83,36.58
ACLOCK  (via drill 0.3)
  Top 0.3: v37.08,22.61 37.08,18.45 RN28.8 | v40.13,38.86 39.88,38.61 39.88,37.59 40.39,37.08 v40.39,31.5
  Bottom 0.3: v37.08,22.61 43.18,28.7 v40.39,31.5 | IC1.12 40.27,39 v40.13,38.86 41.27,40 IC1.14
ACS1
  Bottom 0.3: IC1.53 81.74,44.5 82.55,43.69 82.55,18.33 RN13.8
ACS2  (via drill 0.3)
  Top 0.3: v79.5,42.16 82.55,39.12 82.55,18.33 RN31.5
  Bottom 0.3: IC1.56 78.67,43 v79.5,42.16
ACS12
  Bottom 0.3: IC1.54 80.97,44 81.79,43.18 81.79,18.37 RN13.7
AD0  (via drill 0.3)
  Top 0.3: v47.24,23.62 47.24,18.45 RN29.8
  Bottom 0.3: IC1.89 49.66,26.04 v47.24,23.62
AD1
  Bottom 0.3: IC1.90 49.16,26.81 41.91,19.56 41.91,18.33 RN17.8
AD2  (via drill 0.3)
  Top 0.3: v39.37,21.08 39.37,18.33 RN28.5
  Bottom 0.3: IC1.96 46.16,27.88 v39.37,21.08
AD3
  Bottom 0.3: IC1.91 48.66,27.33 41.15,19.81 41.15,18.37 RN17.7
AD4  (via drill 0.3)
  Top 0.3: v38.61,21.59 38.61,18.37 RN28.6
  Bottom 0.3: IC1.97 45.66,28.65 v38.61,21.59
AD5
  Bottom 0.3: IC1.92 48.16,27.84 40.39,20.07 40.39,18.41 RN17.6
AD6  (via drill 0.3)
  Top 0.3: v37.85,22.1 37.85,18.41 RN28.7
  Bottom 0.3: IC1.98 45.16,29.42 v37.85,22.1
AD7
  Bottom 0.3: IC1.95 46.66,27.36 39.62,20.32 39.62,18.45 RN17.5
AINT  (via drill 0.3)
  Top 0.3: v79.5,37.59 80.26,36.83 80.26,18.45 RN31.8
  Bottom 0.3: IC1.61 76.85,40.5 v79.5,37.59
AIORQ
  Bottom 0.3: IC1.64 59.06,39 59.44,39.37 70.87,39.37 71.63,38.61 71.63,18.37 RN14.7
AM1
  Bottom 0.3: IC1.62 71.51,40 72.39,39.12 72.39,18.33 RN14.8
AMREQ  (via drill 0.3)
  Top 0.3: v68.83,35.05 71.63,32.26 71.63,18.37 RN32.6
  Bottom 0.3: IC1.69 67.39,36.5 v68.83,35.05
ARD  (via drill 0.3)
  Top 0.3: v68.83,33.53 70.87,31.5 70.87,18.41 RN32.7
  Bottom 0.3: IC1.70 66.37,36 v68.83,33.53
ARESET
  Bottom 0.3: IC1.67 69.18,37.5 70.1,36.58 70.1,18.45 RN14.5
ARFSH  (via drill 0.3)
  Top 0.3: v79.5,39.12 81.03,37.59 81.03,18.41 RN31.7
  Bottom 0.3: IC1.58 77.13,42 79.5,39.62 v79.5,39.12
ASLTSL  (via drill 0.3)
  Top 0.3: v79.5,40.64 81.79,38.35 81.79,18.37 RN31.6
  Bottom 0.3: IC1.57 77.65,42.5 v79.5,40.64
AWAIT
  Bottom 0.3: IC1.55 79.44,43.5 80.26,42.67 80.26,18.45 RN13.5
AWR
  Bottom 0.3: IC1.66 69.95,38 70.87,37.08 70.87,18.41 RN14.6
BA0
  Bottom 0.3: 46.99,62.4 RN4.8 46.99,62.66 46.99,62.23 36.07,51.56 36.07,43.18 38.5,40.5 IC1.15
BA1
  Bottom 0.3: IC1.16 38.76,41 36.58,43.43 36.58,51.31 48.51,62.99 48.51,63.25 48.26,63.5 46.98,63.5 RN4.7
BA2
  Bottom 0.3: RN4.6 46.95,64.26 48.77,64.26 49.28,63.75 49.28,62.99 37.08,51.05 37.08,43.69 39.02,41.5 IC1.17
BA3
  Bottom 0.3: RN4.5 46.91,65.02 49.53,65.02 50.04,64.52 50.04,62.99 37.59,50.8 37.59,43.94 39.28,42 IC1.18
BA4
  Bottom 0.3: RN6.8 47.02,70.36 53.09,70.36 53.59,69.85 53.59,65.79 38.1,50.55 38.1,44.2 39.8,42.5 IC1.19
BA5
  Bottom 0.3: RN6.5 46.91,72.64 53.59,72.64 54.1,72.14 54.1,65.53 38.61,50.29 38.61,44.45 40.06,43 IC1.20
BA6
  Bottom 0.3: RN5.8 47.02,77.98 54.1,77.98 54.61,77.47 54.61,65.28 39.12,50.04 39.12,44.7 40.32,43.5 IC1.21
BA7
  Bottom 0.3: RN5.7 46.98,78.74 54.61,78.74 55.12,78.23 55.12,64.52 44.16,53.56 IC1.26
BA8
  Bottom 0.3: RN7.8 71.37,62.15 71.37,59.94 69.34,57.91 50.8,57.91 45.66,52.78 IC1.29
BA9
  Bottom 0.3: RN7.7 71.11,63.5 75.69,63.5 76.2,62.99 76.2,60.96 72.64,57.4 51.05,57.4 46.16,52.52 IC1.30
BA10
  Bottom 0.3: RN7.6 71.08,64.26 76.2,64.26 76.71,63.75 76.71,60.71 72.9,56.9 51.31,56.9 47.66,53.25 IC1.33
BA11
  Bottom 0.3: RN7.5 71.04,65.02 76.71,65.02 77.22,64.52 77.22,60.45 73.15,56.39 51.56,56.39 48.16,52.99 IC1.34
BA12
  Bottom 0.3: RN9.8 71.15,70.36 77.22,70.36 77.72,69.85 77.72,60.2 73.41,55.88 51.82,55.88 48.66,52.73 IC1.35
BA13
  Bottom 0.3: RN9.5 71.04,72.64 77.72,72.64 78.23,72.14 78.23,59.94 73.66,55.37 52.07,55.37 49.16,52.47 IC1.36
BA14
  Bottom 0.3: RN8.8 71.15,77.98 78.23,77.98 78.74,77.47 78.74,59.69 73.91,54.86 52.32,54.86 49.66,52.2 IC1.37
BA15
  Bottom 0.3: RN8.7 71.11,78.74 78.74,78.74 79.25,78.23 79.25,59.44 74.17,54.36 52.58,54.36 50.15,51.93 50.16,48.86 IC1.38
BBUSDIR
  Bottom 0.3: RN12.5 95.17,80.26 97.79,80.26 98.3,79.76 98.3,57.66 85.64,45 IC1.52
BCLOCK  (via drill 0.3)
  Top 0.3: v39.37,39.62 v39.37,31.5 | v41.66,29.21 v43.94,29.21
  Bottom 0.3: RN2.5 22.78,80.26 31.24,80.26 32,79.5 32,46.48 38.23,40 38.61,39.62 v39.37,39.62 | v39.37,31.5 v41.66,29.21 | IC1.100 44.16,29.43 v43.94,29.21
BCS1
  Bottom 0.3: RN10.8 95.5,62.15 95.5,58.67 89.66,52.83 53.34,52.83 51.66,51.16 IC1.41
BCS2
  Bottom 0.3: RN10.7 95.2,63.25 96.01,63.25 96.27,62.99 96.27,58.67 89.92,52.32 53.59,52.32 52.16,50.9 IC1.42
BCS12  (via drill 0.3)
  Top 0.3: v88.9,51.56 89.92,51.56 96.77,58.42 96.77,63.5 96.27,64.01 v96.01,64.01
  Bottom 0.3: RN10.6 95.2,64.26 95.76,64.26 v96.01,64.01 | IC1.43 52.66,50.63 53.85,51.82 88.65,51.82 v88.9,51.56
BD0
  Bottom 0.3: RN1.8 22.89,62.74 27.18,62.74 27.94,61.98 27.94,44.45 38.14,34 38.64,33.5 IC1.1
BD1
  Bottom 0.3: RN1.7 22.85,63.5 27.69,63.5 28.45,62.74 28.45,44.7 38.4,34.5 38.9,34 IC1.2
BD2
  Bottom 0.3: RN1.6 22.82,64.26 28.19,64.26 28.96,63.5 28.96,44.96 38.66,35 39.16,34.5 IC1.3
BD3
  Bottom 0.3: RN1.5 22.78,65.02 28.7,65.02 29.46,64.26 29.46,45.21 38.92,35.5 39.42,35 IC1.4
BD4
  Bottom 0.3: RN3.8 22.89,70.36 29.21,70.36 29.97,69.6 29.97,45.47 39.19,36 39.69,35.5 IC1.5
BD5
  Bottom 0.3: RN3.5 22.78,72.64 29.72,72.64 30.48,71.88 30.48,45.72 39.45,36.5 39.95,36 IC1.6
BD6
  Bottom 0.3: RN2.8 22.89,77.98 30.23,77.98 30.99,77.22 30.99,45.97 39.71,37 40.21,36.5 IC1.7
BD7
  Bottom 0.3: RN2.7 22.85,78.74 30.73,78.74 31.5,77.98 31.5,46.23 38.47,39 40.47,37 IC1.8
BINT
  Bottom 0.3: RN8.6 71.08,79.5 79.25,79.5 79.76,78.99 79.76,59.18 74.42,53.85 52.83,53.85 50.65,51.66 50.66,48.6 IC1.39
BIORQ
  Bottom 0.3: RN12.7 95.24,78.74 97.03,78.74 97.28,78.49 97.28,58.17 86.87,47.75 86.11,47.75 84.58,49.28 56.9,49.28 56.16,48.55 IC1.50
BM1
  Bottom 0.3: RN12.8 95.28,77.98 96.52,77.98 96.77,77.72 96.77,58.42 86.87,48.51 86.36,48.51 85.09,49.78 56.64,49.78 55.66,48.81 IC1.49
BMREQ
  Bottom 0.3: RN12.6 95.2,79.5 97.28,79.5 97.79,78.99 97.79,57.91 85.38,45.5 IC1.51
BRD
  Bottom 0.3: RN5.5 46.91,80.26 55.63,80.26 56.13,79.76 56.13,64.01 45.16,53.04 IC1.28
BRESET
  Bottom 0.3: RN8.5 71.04,80.26 79.5,80.26 80.26,79.5 80.26,58.93 74.68,53.34 53.09,53.34 51.15,51.4 51.16,48.34 IC1.40
BRFSH  (via drill 0.3)
  Top 0.3: v87.38,50.04 89.92,50.04 97.79,57.91 97.79,68.83 97.54,69.09 v96.01,69.09
  Bottom 0.3: RN11.8 95.25,70.02 95.25,69.85 v96.01,69.09 | IC1.47 54.66,49.33 56.13,50.8 86.61,50.8 v87.38,50.04
BSLTSL  (via drill 0.3)
  Top 0.3: v88.14,50.8 89.92,50.8 97.28,58.17 97.28,65.79 97.03,66.04 v96.01,66.04
  Bottom 0.3: RN10.5 95.25,65.11 95.25,65.28 v96.01,66.04 | IC1.44 53.16,50.37 54.1,51.31 87.63,51.31 v88.14,50.8
BUSDIR
  Top 0.3: RN32.4 72.9,16.66 | 72.9,16.66 73.4,16.66 arc-45 73.58,16.59 74.93,15.24 CN1.10 | CN2.P$10 69.85,89.92 78.23,81.53 78.23,51.31 72.9,45.97 72.9,38.35 76.45,34.8 76.45,23.37 74.42,21.34 74.42,18.19 72.9,16.66
BWAIT  (via drill 0.3)
  Top 0.3: v86.61,49.28 89.92,49.28 98.3,57.66 98.3,73.66 98.04,73.91 v96.01,73.91
  Bottom 0.3: RN11.5 95.25,72.73 95.25,73.15 v96.01,73.91 | IC1.48 55.16,49.07 56.39,50.29 85.6,50.29 v86.61,49.28
BWR
  Bottom 0.3: RN5.6 46.95,79.5 55.12,79.5 55.63,78.99 55.63,64.26 44.66,53.3 IC1.27
CLOCK  (via drill 0.3)
  Top 0.254: 33.71,1.14 34.29,1.27
  Top 0.3: RN28.1 35.82,16.66 arc45 35.64,16.59 34.29,15.24 34.29,14.48 | 34.29,14.48 CN1.42 | CN2.P$42 28.71,90.18 19.81,81.28 19.81,50 26.16,43.65 v26.16,31.5 | v33.02,14.48 34.29,14.48
  Bottom 0.3: v26.16,31.5 26.16,21.34 v33.02,14.48
CS1  (via drill 0.3)
  Top 0.3: CN2.P$1 80.76,95.26 87.88,88.14 87.88,53.85 84.58,50.55 84.58,49.28 v87.88,45.97 | v87.88,43.43 87.88,17.02 v87.12,16.26
  Bottom 0.3: RN13.1 83.56,16.66 arc-45 83.74,16.59 85.09,15.24 | 85.09,15.24 CN1.01 | v87.12,16.26 86.11,16.26 85.09,15.24 | v87.88,45.97 v87.88,43.43
CS2
  Top 0.3: RN31.4 83.56,16.66 arc-45 83.74,16.59 84.84,15.49 | 84.84,15.49 85.09,15.24 CN1.02 | CN2.P$2 84.83,90.18 87.12,87.88 87.12,53.85 83.82,50.55 83.82,47.75 87.12,44.45 87.12,17.78 84.84,15.49
CS12  (via drill 0.3)
  Top 0.3: CN2.P$3 78.74,93.98 78.74,89.66 79.76,88.65 85.34,88.65 86.36,87.63 86.36,53.85 83.06,50.55 83.06,47.5 86.36,44.2 86.36,19.56 v84.33,17.53
  Bottom 0.3: CN1.03 82.55,14.92 81.75,15.72 arc-45 81.68,15.9 RN13.2 81.79,16.77 81.79,17.27 82.04,17.53 v84.33,17.53
D0  (via drill 0.3)
  Top 0.3: RN29.1 45.98,16.66 arc45 45.8,16.59 45.21,16 | 45.21,16 44.45,15.24 CN1.34 | CN2.P$34 39.37,88.39 36.32,85.34 36.32,59.44 35.05,58.17 35.05,32.26 v34.29,31.5 | v37.08,27.43 44.96,19.56 44.96,16.26 45.21,16
  Bottom 0.3: v34.29,31.5 34.29,30.23 v37.08,27.43
D1  (via drill 0.3)
  Top 0.3: CN2.P$33 39.37,93.47 38.1,92.2 38.1,89.41 25.15,76.45 25.15,53.25 33.27,45.12 v33.27,31.5 | v37.08,26.42 v44.2,19.3
  Bottom 0.3: RN17.1 42.92,16.66 arc-45 43.1,16.59 43.81,15.88 | 43.81,15.88 44.45,15.24 CN1.33 | v33.27,31.5 33.27,29.97 36.83,26.42 v37.08,26.42 | v44.2,19.3 44.2,16.26 43.81,15.88
D2  (via drill 0.3)
  Top 0.3: RN28.4 40.06,16.66 arc-45 40.24,16.59 41.91,14.92 41.91,13.72 | 41.91,13.72 CN1.36 | CN2.P$36 36.83,89.41 24.38,76.96 24.38,52.85 32.26,44.97 v32.26,31.5 | v37.08,25.4 43.43,19.05 43.43,15.24 41.91,13.72
  Bottom 0.3: v32.26,31.5 32.26,29.97 36.83,25.4 v37.08,25.4
D3  (via drill 0.3)
  Top 0.3: CN2.P$35 36.83,93.47 35.56,92.2 35.56,89.41 23.62,77.47 23.62,52.5 31.24,44.88 v31.24,31.5 | v42.67,15.49 41.15,17.02 41.15,20.32 37.59,23.88 37.34,23.88 v37.08,24.13
  Bottom 0.3: RN17.2 41.04,15.9 arc45 41.11,15.72 41.91,14.92 41.91,14.48 | 41.91,14.48 CN1.35 | v31.24,31.5 31.24,29.97 v37.08,24.13 | v42.67,15.49 42.67,15.24 41.91,14.48
D4  (via drill 0.3)
  Top 0.3: CN1.38 39.37,15.24 38.57,16.04 arc-45 38.5,16.21 RN28.3 38.35,16.81 38.35,17.27 38.1,17.53 33.78,17.53 30.23,21.08 v30.23,22.1 | CN2.P$38 34.29,89.41 22.86,77.98 22.86,52 30.23,44.63 v30.23,31.5
  Bottom 0.3: v30.23,31.5 v30.23,22.1
D5  (via drill 0.3)
  Top 0.3: CN2.P$37 34.29,93.47 33.02,92.2 33.02,89.41 22.1,78.49 22.1,51.5 29.21,44.39 v29.21,31.5
  Bottom 0.3: CN1.37 39.37,14.92 40.17,15.72 arc45 40.24,15.9 RN17.3 40.13,16.77 40.13,17.27 39.88,17.53 33.78,17.53 29.21,22.1 v29.21,31.5
D6  (via drill 0.3)
  Top 0.3: RN28.2 37.7,16.21 arc-45 37.63,16.04 36.83,15.24 | 36.83,15.24 CN1.40 | CN2.P$40 31.75,89.41 21.34,78.99 21.34,51 28.19,44.14 v28.19,31.5 | v36.07,16 36.83,15.24
  Bottom 0.3: v28.19,31.5 28.19,21.84 34.04,16 v36.07,16
D7  (via drill 0.3)
  Top 0.3: CN2.P$39 31.75,93.47 30.48,92.2 30.48,89.41 20.57,79.5 20.57,50.5 27.18,43.9 v27.18,31.5
  Bottom 0.3: RN17.4 38.36,16.66 arc45 38.18,16.59 36.83,15.24 36.83,14.99 | 36.83,14.99 CN1.39 | v27.18,31.5 27.18,21.59 33.53,15.24 36.58,15.24 36.83,14.99
GND  (via drill 0.3, 0.5)
  Bottom 0.254: 31.65,10.52 31.75,7.62
  Bottom 0.3: 47.16,48.85 v46.99,49.02
  Bottom 0.4: IC1.10 40.74,38 v40.64,38.1 41.04,38.5 IC1.11 | IC1.60 59.54,41 v59.69,41.15 | IC1.46 54.16,48.7 v53.85,49.02 | IC1.65 59.58,38.5 v59.69,38.61 | IC1.32 47.16,48.85 | IC1.93 47.66,30.14 v47.5,29.97 | IC1.79 54.66,30.28 v54.36,29.97
  other vias: 45.97,35.56 5.84,92.71 5.84,50.29 15.49,35.8 26.42,16.76 28.96,14.22 27.69,15.49 98.04,14.22 98.04,55.12 98.04,98.81 1.52,98.81 54.1,35.56 45.97,43.69 54.1,43.69 24.64,30.48 10.92,14.22 20.03,47.71 17.53,56.13 44.45,86.87 1.27,22.86 24.64,24.13 7.62,75.18 53.09,99.06 14.48,25.15 7.62,59.94 46.99,50.04 53.85,50.04 47.5,28.96 54.36,28.96 89.15,55.12 93.98,74.05 45.72,86.87 84.33,20.57 84.33,39.43 67.06,41.24 76.78,41.24 71.12,76.45 70.1,38.7 24.89,18.03 30.23,12.95 34.03,46.29 26.67,53.59 27.69,75.18 27.69,67.82 71.12,66.29 50.8,99.06 94.23,67.82 82.55,55.12 14.73,17.53 90.17,90.42 15.49,30.23 34.13,34.29
  pour Bottom: 0,100.33 99.57,100.33 99.57,12.7 87.63,12.7 87.63,9.14 21.84,9.14 21.84,12.7 9.65,12.7 9.65,21.59 0,21.59
  pour Top: 0,100.33 99.57,100.33 99.57,12.7 87.38,12.7 87.38,9.14 21.84,9.14 21.84,12.7 9.65,12.7 9.65,21.59 0,21.59
  pour Top: 83.31,45.21 81.79,46.74 81.79,49.78 76.45,44.45 76.45,40.39 78.74,38.1 78.74,43.18 80.01,43.18 83.31,39.88
  pour Top: 64.77,58.67 73.15,58.67 73.15,53.34 67.82,48.01 67.82,41.4 66.29,39.88 66.29,47.5 64.77,49.02
  pour Top: 70.87,40.39 68.83,38.35 68.83,37.34 69.09,37.34 72.9,33.53 72.9,22.86 74.42,24.38 74.42,33.53 70.87,37.34
  pour Top: 85.09,20.07 83.31,18.29 83.31,45.21 85.09,43.43
  pour Top: 34.54,32.77 32.77,32.77 25.65,39.88 25.65,54.61 34.54,54.61
  pour Top: 81.03,58.67 84.33,58.67 84.33,54.1 81.03,50.8
  pour Top: 25.65,59.44 25.65,76.2 32.26,82.8 32.26,59.44
  pour Top: 22.61,16.76 14.48,16.76 12.95,18.29 12.95,22.1 14.22,20.83 14.22,18.54 20.83,18.54
GND1
  Bottom 1.016: CN2.P$41 CN2.P$43 26.67,94.94 24.48,92.75 16.73,92.75 16.61,92.62 | 16.61,92.62 13.98,90 12.11,90 JP1.3 | JP1.7 14.11,95.12 16.61,92.62
INT
  Top 0.3: RN31.1 79,16.66 arc45 78.82,16.59 78.61,16.38 | 78.61,16.38 77.47,15.24 CN1.08 | CN2.P$8 72.39,89.66 79.76,82.3 79.76,50.8 74.42,45.47 74.42,39.12 77.98,35.56 77.98,22.86 76.45,21.34 76.45,18.54 78.61,16.38
IORQ  (via drill 0.3)
  Top 0.3: CN2.P$11 67.31,93.22 68.58,91.95 68.58,89.66 77.47,80.77 77.47,51.56 72.14,46.23 72.14,37.85 75.69,34.29 75.69,23.62 73.66,21.59 v73.66,18.54
  Bottom 0.3: CN1.11 72.39,14.92 71.59,15.72 arc-45 71.52,15.9 RN14.2 71.63,16.77 71.63,17.27 71.88,17.53 72.9,17.53 73.66,18.29 v73.66,18.54
M1  (via drill 0.3)
  Top 0.3: CN2.P$9 69.85,92.46 71.12,91.19 71.12,89.66 78.99,81.79 78.99,51.05 73.66,45.72 73.66,38.61 77.22,35.05 77.22,23.11 75.18,21.08 75.18,18.03 v74.42,17.27
  Bottom 0.3: RN14.1 73.4,16.66 arc-45 73.58,16.59 73.66,16.51 | 73.66,16.51 74.93,15.24 CN1.09 | v74.42,17.27 73.66,16.51
MREQ
  Top 0.3: CN1.12 72.39,14.92 71.59,15.72 arc-45 71.52,15.9 RN32.3 71.63,16.77 71.63,17.27 71.88,17.53 72.9,17.53 72.9,19.05 73.15,19.3 73.15,22.1 74.93,23.88 74.93,34.04 71.37,37.59 71.37,46.48 76.71,51.82 76.71,80.52 67.31,89.92 CN2.P$12
N$1
  Bottom 0.3: R1.1 86.49,94.91 LED1.A
N$2
  Bottom 0.5: RN10.1 93.5,61.49 91.95,59.94 LB4.11
N$4
  Bottom 0.5: RN10.2 91.04,63.35 LB4.12
N$5
  Bottom 0.5: RN10.3 91.04,64.15 LB4.13
N$6
  Bottom 0.5: RN10.4 93.5,66.01 91.95,67.56 LB4.14
N$7
  Bottom 0.5: RN11.1 90.24,70.17 LB4.15
N$8
  Bottom 0.5: RN11.4 90.24,72.57 LB4.16
N$9
  Bottom 0.5: RN12.1 93.5,76.73 91.95,75.18 LB4.17
N$10
  Bottom 0.5: RN12.2 91.04,78.59 LB4.18
N$11
  Bottom 0.5: RN12.3 91.04,79.39 LB4.19
N$12
  Bottom 0.5: RN12.4 93.5,81.25 91.95,82.8 LB4.20
N$13
  Bottom 0.5: RN1.1 21.11,61.49 19.56,59.94 LB1.11
N$14
  Bottom 0.5: RN1.2 18.65,63.35 LB1.12
N$15
  Bottom 0.5: RN1.3 18.65,64.15 LB1.13
N$16
  Bottom 0.5: RN1.4 21.11,66.01 19.56,67.56 LB1.14
N$17
  Bottom 0.5: RN3.1 17.85,70.17 LB1.15
N$18
  Bottom 0.5: RN3.4 17.85,72.57 LB1.16
N$19
  Bottom 0.5: RN2.1 21.11,76.73 19.56,75.18 LB1.17
N$20
  Bottom 0.5: RN2.2 18.65,78.59 LB1.18
N$21
  Bottom 0.5: RN2.3 18.65,79.39 LB1.19
N$22
  Bottom 0.5: RN2.4 21.11,81.25 19.56,82.8 LB1.20
N$23
  Bottom 0.5: RN4.1 45.24,61.49 43.69,59.94 LB2.11
N$24
  Bottom 0.5: RN4.2 42.78,63.35 LB2.12
N$25
  Bottom 0.5: RN4.3 42.78,64.15 LB2.13
N$26
  Bottom 0.5: RN4.4 45.24,66.01 43.69,67.56 LB2.14
N$27
  Bottom 0.5: RN6.1 41.98,70.17 LB2.15
N$28
  Bottom 0.5: RN6.4 41.98,72.57 LB2.16
N$29
  Bottom 0.5: RN5.1 45.24,76.73 43.69,75.18 LB2.17
N$30
  Bottom 0.5: RN5.2 42.78,78.59 LB2.18
N$31
  Bottom 0.5: RN5.3 42.78,79.39 LB2.19
N$32
  Bottom 0.5: RN5.4 45.24,81.25 43.69,82.8 LB2.20
N$33
  Bottom 0.5: RN7.1 69.37,61.49 67.82,59.94 LB3.11
N$34
  Bottom 0.5: RN7.2 66.91,63.35 LB3.12
N$35
  Bottom 0.5: RN7.3 66.91,64.15 LB3.13
N$36
  Bottom 0.5: RN7.4 69.37,66.01 67.82,67.56 LB3.14
N$37
  Bottom 0.5: RN9.1 66.11,70.17 LB3.15
N$38
  Bottom 0.5: RN9.4 66.11,72.57 LB3.16
N$39
  Bottom 0.5: RN8.1 69.37,76.73 67.82,75.18 LB3.17
N$40
  Bottom 0.5: RN8.2 66.91,78.59 LB3.18
N$41
  Bottom 0.5: RN8.3 66.91,79.39 LB3.19
N$42
  Bottom 0.5: RN8.4 69.37,81.25 67.82,82.8 LB3.20
N$46
  pour Bottom: 37.34,14.73 84.58,14.73 84.58,9.14 37.34,9.14
N$47
  pour Top: 34.8,14.73 84.58,14.73 84.58,9.14 34.8,9.14
N$50
  pour Top: 27.18,11.68 28.7,11.68 28.7,9.14 27.18,9.14
N$51
  pour Top: 24.64,11.68 26.16,11.68 26.16,9.14 24.64,9.14
N$54
  pour Top: 54.36,22.1 56.64,19.81 56.64,18.29 54.36,20.57
RD
  Top 0.3: CN1.14 69.85,14.92 70.65,15.72 arc45 70.72,15.9 RN32.2 70.72,17.42 70.61,17.53 68.83,17.53 68.07,18.29 68.07,20.07 68.58,20.57 68.58,29.97 67.56,30.99 67.56,38.86 69.85,41.15 69.85,46.99 75.18,52.32 75.18,79.25 64.77,89.66 CN2.P$14
RESET  (via drill 0.3)
  Top 0.3: CN2.P$15 62.23,93.22 63.5,91.95 63.5,89.66 74.42,78.74 74.42,52.58 69.09,47.24 69.09,41.15 67.06,39.12 67.06,30.48 67.82,29.72 67.82,21.08 67.31,20.57 67.31,17.78 v67.56,17.53
  Bottom 0.3: RN14.4 68.84,16.66 | 68.84,16.66 arc45 68.66,16.59 67.31,15.24 CN1.15 | v67.56,17.53 67.97,17.53 68.84,16.66
RFSH
  Top 0.3: CN1.06 80.01,14.92 80.81,15.72 arc45 80.88,15.9 RN31.2 80.77,16.77 80.77,17.27 80.52,17.53 79.25,17.53 78.74,18.03 78.74,18.8 79.5,19.56 79.5,36.32 75.95,39.88 75.95,44.96 84.84,53.85 84.84,86.36 84.33,86.87 78.74,86.87 75.43,90.18 CN2.P$6
SLTSL
  Top 0.3: CN1.04 82.55,14.92 81.75,15.72 arc-45 81.68,15.9 RN31.3 81.79,16.77 81.79,17.27 82.04,17.53 83.31,17.53 85.6,19.81 85.6,43.94 82.3,47.24 82.3,50.55 85.6,53.85 85.6,86.87 84.84,87.63 79.5,87.63 77.47,89.66 CN2.P$4
SNDIN  (via drill 0.6)
  Top 0.5: CN2.P$49 17.91,96.39 2.54,96.39 1.27,95.12 1.27,87.76 v1.52,87.5
  Bottom 0.5: 1.27,24.77 1.27,87.25 v1.52,87.5
  Bottom 0.508: CN1.49 24.13,12.06 22.23,13.97 13.97,13.97 10.79,17.14 10.79,22.23 9.53,23.5 2.54,23.5 1.27,24.77
SW1
  Top 0.3: CN2.P$44 23.61,87.12 19.56,87.12 11.43,78.99 7.62,78.99 4.57,75.95 4.57,27.43 5.08,26.92 11.18,26.92 16.38,21.72 SJ1.1 20.69,21.66 arc45 20.87,21.59 23.37,21.59 31.75,13.21 CN1.44
SW2
  Top 0.3: CN1.46 29.21,11.52 arc45 29.14,11.7 SJ1.2 17.14,20.19 16.26,21.08 15.49,21.08 10.67,25.91 4.83,25.91 3.56,27.18 3.56,78.99 6.1,81.53 11.94,81.53 18.8,88.39 22.34,88.39 CN2.P$46
SWITCH  (via drill 0.3)
  Top 0.3: v45.21,33.02 v56.64,33.02 | v56.64,38.61 v56.64,42.42 | v85.09,47.5 87.38,45.21 88.9,45.21 88.9,45.97 85.34,49.53 85.34,49.78 92.71,57.15 92.71,84.07 97.28,88.65 97.28,90.17 SW1.1
  Bottom 0.3: IC1.99 44.66,32.47 v45.21,33.02 | v56.64,33.02 v56.64,38.61 | v56.64,42.42 56.64,45.72 59.69,48.77 83.82,48.77 v85.09,47.5 | R5.2 91.88,95.57 SW1.1
TCK  (via drill 0.3)
  Top 0.3: v42.16,48.77 42.67,49.28 42.67,54.61 39.88,57.4 v39.37,57.4 | v33.53,57.4 v26.42,57.4 | v13.97,43.69 13.97,32.27 X1.1
  Bottom 0.3: IC1.24 41.11,45 40.64,45.47 40.64,47.24 v42.16,48.77 | v39.37,57.4 v33.53,57.4 | v13.97,43.69 14.73,44.45 14.73,46.23 25.91,57.4 v26.42,57.4
  Bottom 0.4: X1.1 12.25,29.52 11.18,28.45 6.67,28.45 R2.1
TDI  (via drill 0.3)
  Top 0.3: v41.66,49.53 41.91,49.78 41.91,53.85 39.37,56.39 v38.86,56.39 | v33.53,56.39 v26.42,56.39
  Bottom 0.3: IC1.23 40.85,44.5 40.13,45.21 40.13,48.01 v41.66,49.53 | v38.86,56.39 v33.53,56.39 | v26.42,56.39 25.91,56.39 15.24,45.72 15.24,43.7 X1.9
TDO  (via drill 0.3)
  Top 0.3: v42.42,47.75 43.43,48.77 43.43,55.37 v40.39,58.42 | v33.53,58.42 v26.42,58.42 | v10.92,42.16 10.92,34.41 X1.3
  Bottom 0.3: IC1.25 41.37,45.5 41.15,45.72 41.15,46.48 v42.42,47.75 | v40.39,58.42 v33.53,58.42 | v26.42,58.42 25.91,58.42 14.22,46.74 14.22,45.47 v10.92,42.16
TMS  (via drill 0.3)
  Top 0.3: v41.15,50.29 41.15,53.09 v38.86,55.37 | v33.53,55.37 v26.42,55.37
  Bottom 0.3: IC1.22 40.58,44 39.62,44.96 39.62,48.77 v41.15,50.29 | v38.86,55.37 v33.53,55.37 | v26.42,55.37 25.91,55.37 15.75,45.21 15.75,42.16 12.95,39.37 11.68,39.37 10.92,38.61 10.92,36.95 X1.5
  Bottom 0.4: 10.92,36.95 10.8,36.83 8.64,36.83 7.62,37.85 7.62,41.4 6.86,42.16 5.91,42.16 R3.1
VCC3V  (via drill 0.6)  (2 unrouted)
  Top 0.3: C4.2 52,34.1 v52.07,34.04
  Top 1: v48.51,34.04 v52.07,34.04 | 50.29,45.21 v48.51,45.21 v52.07,45.21
  Top 1.5: v17.23,38.5 v22.98,38.5 v22.98,33.25 v17.23,33.25 v17.23,38.5
  Bottom 0.3: 47.16,33.96 47.24,34.04 | 54.16,33.84 54.36,34.04
  Bottom 0.4: IC1.45 53.66,45.54 53.34,45.21 | IC1.31 46.66,45.4 46.48,45.21 | IC1.59 55.72,41.5 55.63,41.4 | IC1.63 55.75,39.5 55.63,39.37 | IC1.9 44.04,37.5 44.45,37.08 | IC1.13 44.32,39.5 44.45,39.37 | IC1.94 47.16,33.96 | IC1.80 54.16,33.84 | 20.96,32.64 20.83,32.77 20.07,32.51 18.03,32.51 17.02,31.75 10.41,31.75 9.71,32.45 X1.4 5.84,36.95 R3.2
  Bottom 1: 37.59,33.02 37.85,33.02 38.35,32.51 43.18,32.51 44.7,34.04
  Bottom 1.016: C5.2 20.32,30.32 VREG1.2 | 20.07,30.73 20.07,31.75 20.96,32.64 21.34,33.02 37.59,33.02 | 44.45,45.21 46.48,45.21 v48.51,45.21 v52.07,45.21 53.34,45.21 55.63,45.21 55.63,41.4 55.63,39.37 55.63,34.04 54.36,34.04 v52.07,34.04 v48.51,34.04 47.24,34.04 44.7,34.04 44.45,34.04 44.45,37.08 44.45,39.37 44.45,45.21
  Bottom 1.5: v17.23,38.5 v22.98,38.5 v22.98,33.25 v17.23,33.25 v17.23,38.5
  other vias: 19.23,33.25 20.98,33.25 19.23,38.5 20.98,38.5 17.23,36.75 22.98,36.75 17.23,35 19.23,35 20.98,35 22.98,35
  pour Bottom: 16.73,39 23.48,39 23.48,32.75 16.73,32.75
  pour Top: 16.73,39 23.48,39 23.48,32.75 16.73,32.75
WAIT  (via drill 0.3)
  Top 0.3: CN2.P$7 72.39,92.71 73.66,91.44 73.66,89.41 80.52,82.55 80.52,50.55 75.18,45.21 75.18,39.37 78.74,35.81 78.74,22.35 v77.22,20.83
  Bottom 0.3: RN13.4 79,16.66 arc45 78.82,16.59 | 78.82,16.59 77.47,15.24 CN1.07 | v77.22,20.83 77.22,18.19 78.82,16.59
WR  (via drill 0.3)
  Top 0.3: CN2.P$13 64.77,93.22 66.04,91.95 66.04,89.66 75.95,79.76 75.95,52.07 70.61,46.74 70.61,41.15 68.07,38.61 68.07,31.5 69.34,30.23 69.34,20.07 v69.09,19.81
  Bottom 0.3: CN1.13 69.85,14.92 70.65,15.72 arc45 70.72,15.9 RN14.3 70.61,16.77 70.61,17.27 70.36,17.53 69.6,17.53 69.09,18.03 v69.09,19.81

### Text on the board
tNames: +5V MAIN | POWER | MODE | CLK | CLK | RD | RD | RST | RST | BUSD | BUSD | WR | WR | INT | INT | MERQ | MERQ | D7 | D7 | A7 | A7 | A15 | A15 | IORQ | IORQ | D6 | D6 | A6 | A6 | A14 | A14 | M1 | M1 | D5 | D5 | A5 | A5 | A13 | A13 | WAIT | WAIT | D4 | D4 | A4 | A4 | A12 | A12 | RFSH | RFSH | D3 | D3 | A3 | A3 | A11 | A11 | SLTS | SLTS | D2 | D2 | A2 | A2 | A10 | A10 | CS12 | CS12 | D1 | D1 | A1 | A1 | A9 | A9 | CS2 | CS2 | D0 | D0 | A0 | A0 | A8 | A8 | CS1 | CS1 | DIAGNOSTICS CARTRIDGE | RBSC | 2024 | W | JTAG | iBOLIT2 | SW1+2 | Board Version 1.1
bNames: MODE | 1k | 1k | 1k | 1k | 1k | 1k | 1k | 1k | 1k | 1k | 1k | 1k | DIAGNOSTICS CARTRIDGE | W | C5 | 22-47uF | iBOLIT2 | + | 1N4734A | RBSC | 330 | 330 | 330 | 330 | 330 | FUSE 1A/2A | 2024 | Board Version 1.1